# Altium project 025619-TurtleBot4 UI board.PrjPcb (part 1 of 3)
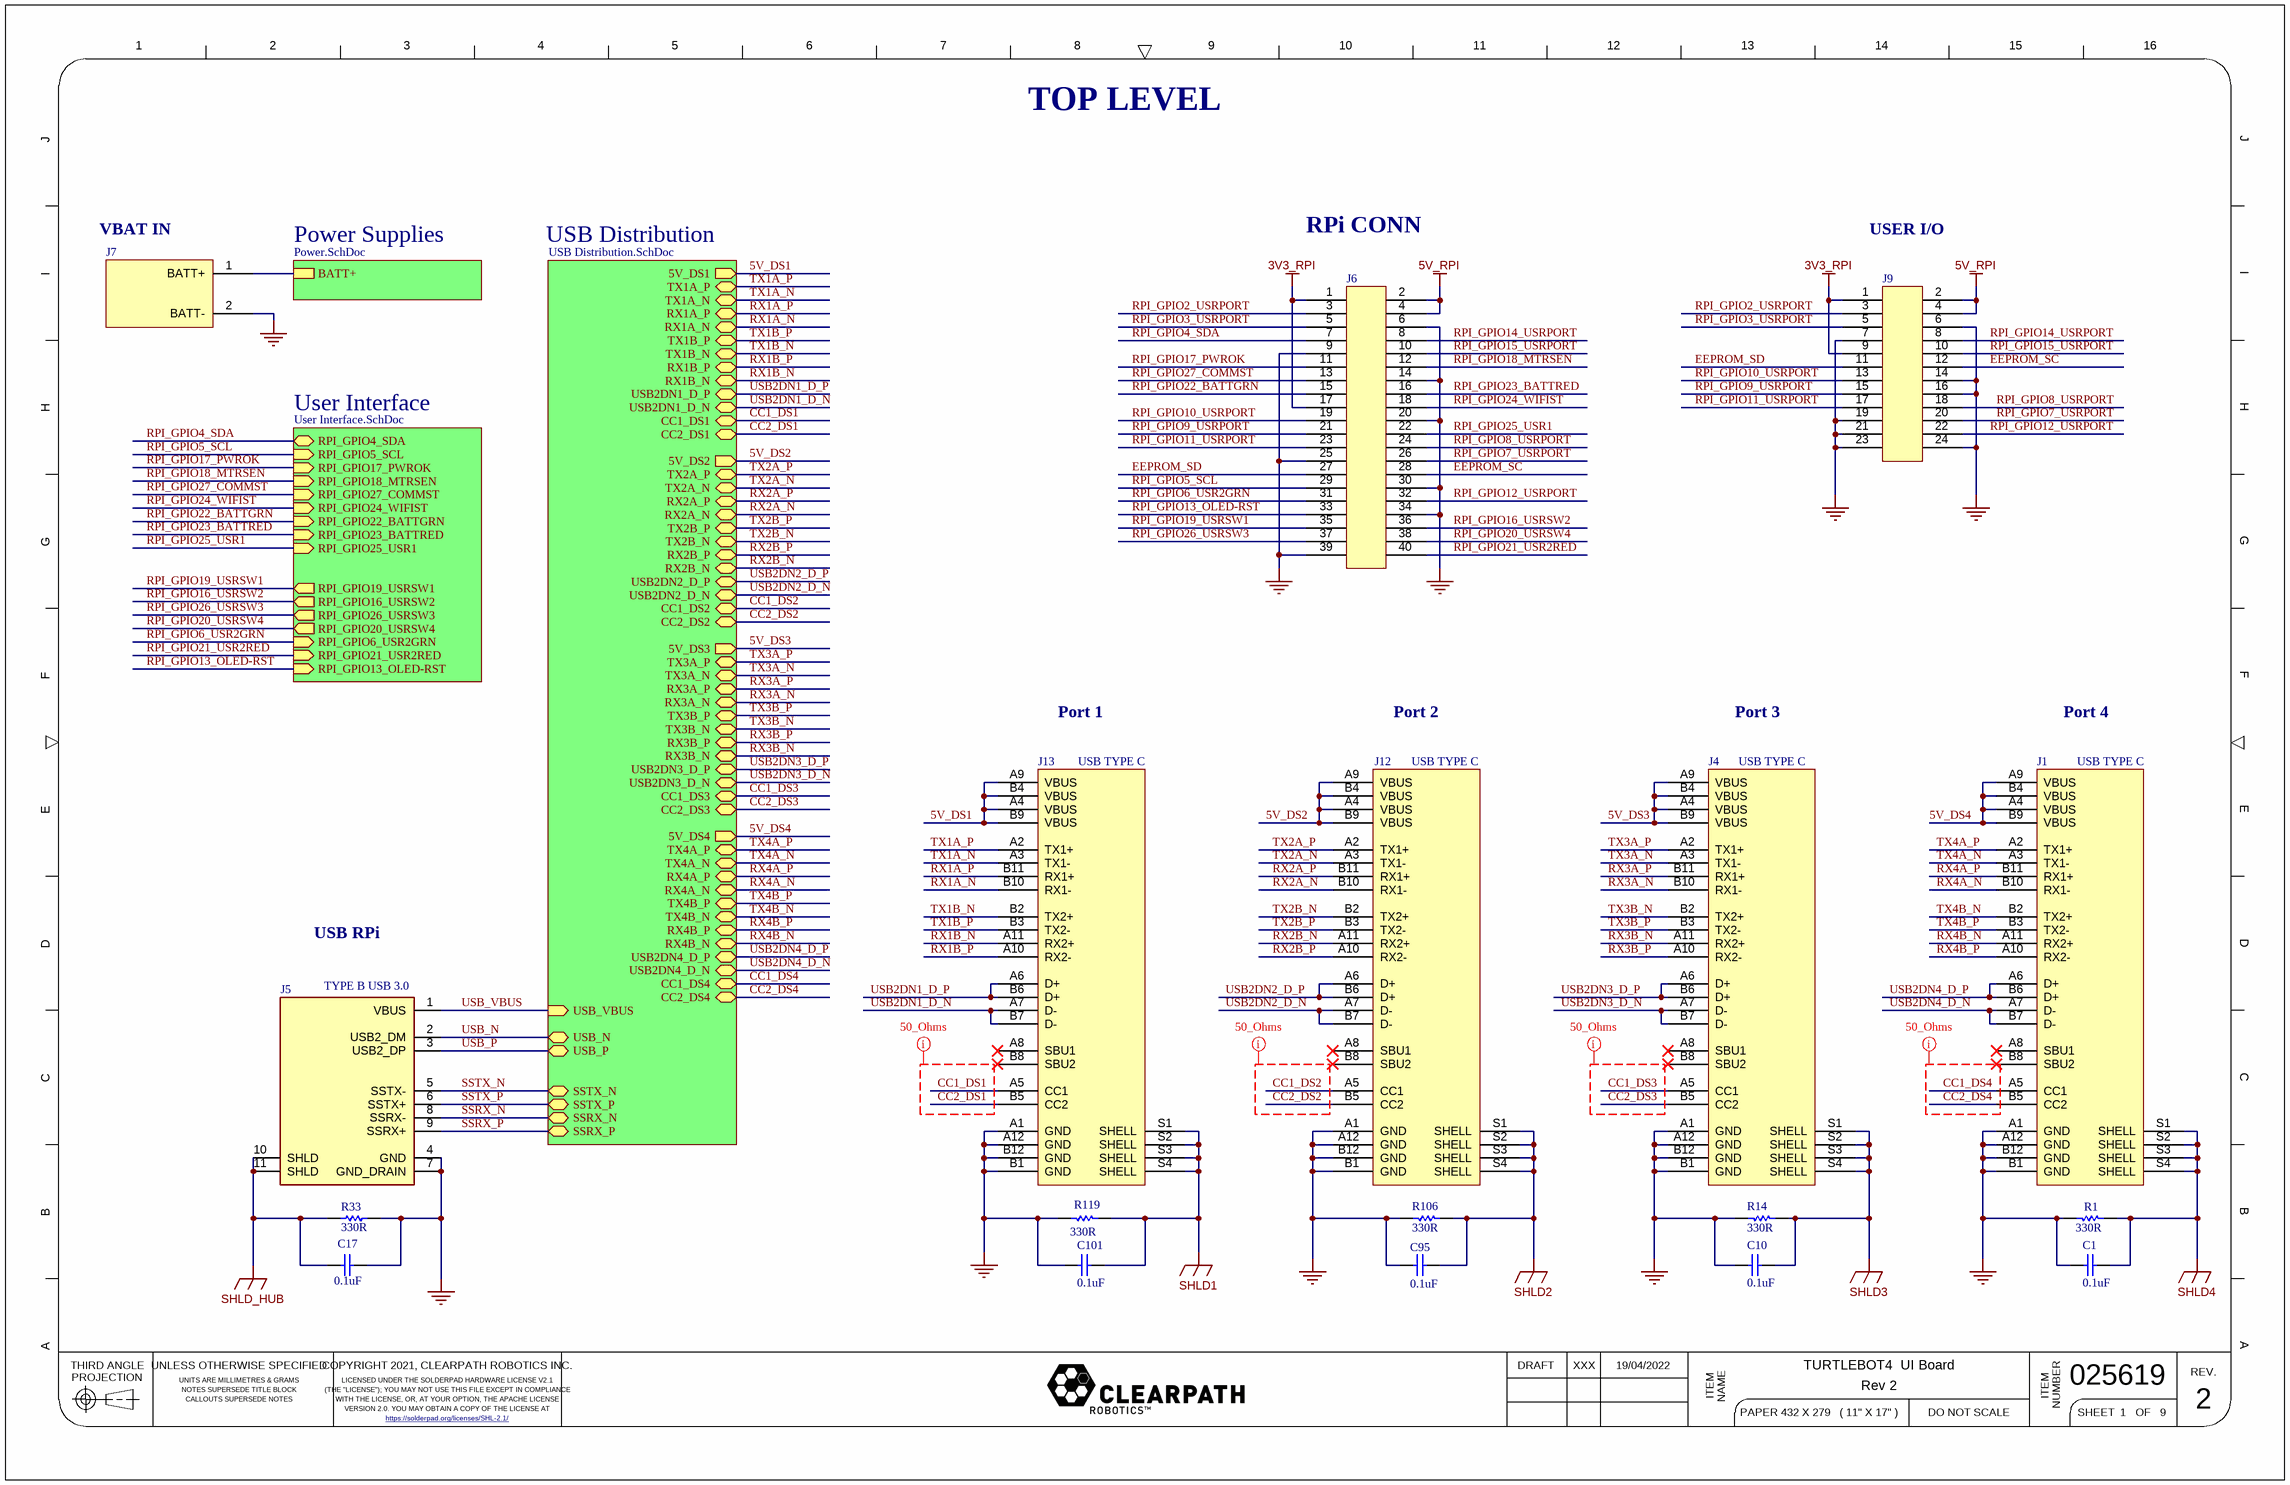
[diagram p0: Top Level.SchDoc]
9 sheets, 378 parts. Net scope: hierarchical (ports join the sheet entries above them; power ports are global).
Board file: 025618-TurtleBot4 UI board .PcbDoc
Sheets:
  Top Level.SchDoc
    User Interface = User Interface.SchDoc
    USB Distribution = USB Distribution.SchDoc
      USB Downstream Port 4 = USB Downstream Type C Port 4.SchDoc
      USB Downstream Port 3 = USB Downstream Type C Port 3.SchDoc
      USB Downstream Port 2 = USB Downstream Type C Port 2.SchDoc
      USB3.0 HUB = USB Hub.SchDoc
      USB Downstream Port 1 = USB Downstream Type C Port 1.SchDoc
    Power Supplies = Power.SchDoc

## Sheet Top Level.SchDoc
size Tabloid; Author: Arash Ghaderi; SheetNumber: 1; SheetTotal: 9; PageSetup: Record=PageOptions|CenterHorizontal=True|CenterVertical=True|PrintScale=1.00|XCorrection=1.00|YCorrection=1.00|PrintKind=1|BorderSize=5000000|LeftOffset=0|BottomOffset=0|Orientation=2|PaperLength=1000|PaperWidth=1000|Scale=100|PaperSource=7|PrintQuality=-4|MediaType=1|DitherType=10|PaperKind=Ledger|PrintScaleMode=1; cpr-ItemNumber: 025619; cpr-ItemName1: TURTLEBOT4  UI Board; cpr-ItemName2: Rev 2; cpr-Revision: 2; cpr-SheetNumber: 1; cpr-SheetTotal: 9; cpr-Draft: XXX; cpr-DraftDate: 19/04/2022; cpr-Rigour1: X; cpr-Rigour2: X; cpr-Rigour1Date: X; cpr-Rigour2Date: X

### Parts
C1  value 0.1uF  [C0805]  (hidden comment: Capacitor _SMT)
C10  value 0.1uF  [C0805]  (hidden comment: Capacitor _SMT)
C17  value 0.1uF  [C0805]  (hidden comment: Capacitor _SMT)
C95  value 0.1uF  [C0805]  (hidden comment: Capacitor _SMT)
C101  value 0.1uF  [C0805]  (hidden comment: Capacitor _SMT)
J1  USB TYPE C  [MOLEX_2012670005]
J4  USB TYPE C  [MOLEX_2012670005]
J5  TYPE B USB 3.0  [1003-024-02000]
J6  Conn_2X20_2  [Conn_2X20_SMT]  (value not drawn)
J7  JST Power Connector  [JST_S2B]  (value not drawn)
J9  AUX_CONNECTOR  [SULLINS_SBH11-NBPC-D12-SM-BK]  (value not drawn)
J12  USB TYPE C  [MOLEX_2012670005]
J13  USB TYPE C  [MOLEX_2012670005]
R1  value 330R  [R0805]  (hidden comment: Resistor_SMT)
R14  value 330R  [R0805]  (hidden comment: Resistor_SMT)
R33  value 330R  [R0805]  (hidden comment: Resistor_SMT)
R106  value 330R  [R0805]  (hidden comment: Resistor_SMT)
R119  value 330R  [R0805]  (hidden comment: Resistor_SMT)

### Sub-sheets
Power Supplies = Power.SchDoc: BATT+
USB Distribution = USB Distribution.SchDoc: RX1A_N (bidir), TX1B_N (bidir), TX1B_P (bidir), CC2_DS1 (bidir), CC1_DS1 (bidir), TX1A_N (bidir), 5V_DS1 (out), TX1A_P (bidir), USB2DN1_D_N (bidir), RX1B_P (bidir), RX1B_N (bidir), RX1A_P (bidir), USB2DN1_D_P (bidir), SSTX_P (bidir), USB_P (bidir), USB_N (bidir), USB_VBUS (in), SSRX_P (bidir), SSRX_N (bidir), SSTX_N (bidir), TX3A_P (bidir), CC1_DS4 (bidir), 5V_DS4 (out), RX2B_N (bidir), TX3B_N (bidir), RX4B_N (bidir), RX2A_N (bidir), USB2DN2_D_P (bidir), USB2DN4_D_N (bidir), RX4A_N (bidir), RX3B_P (bidir), TX4B_N (bidir), RX3A_N (bidir), CC2_DS4 (bidir), TX3A_N (bidir), 5V_DS2 (out), TX4A_P (bidir), RX3B_N (bidir), TX4B_P (bidir), CC2_DS2 (bidir), TX2A_N (bidir), USB2DN3_D_N (bidir), TX4A_N (bidir), RX2B_P (bidir), TX3B_P (bidir), RX4B_P (bidir), TX2B_P (bidir), TX2A_P (bidir), TX2B_N (bidir), USB2DN4_D_P (bidir), 5V_DS3 (out), USB2DN3_D_P (bidir), CC2_DS3 (bidir), RX4A_P (bidir), RX2A_P (bidir), USB2DN2_D_N (bidir), RX3A_P (bidir), CC1_DS3 (bidir), CC1_DS2 (bidir)
User Interface = User Interface.SchDoc: RPI_GPIO27_COMMST (in), RPI_GPIO24_WIFIST (in), RPI_GPIO18_MTRSEN (in), RPI_GPIO5_SCL (in), RPI_GPIO17_PWROK (in), RPI_GPIO23_BATTRED (in), RPI_GPIO20_USRSW4 (out), RPI_GPIO4_SDA (bidir), RPI_GPIO22_BATTGRN (in), RPI_GPIO25_USR1 (in), RPI_GPIO6_USR2GRN (in), RPI_GPIO21_USR2RED (in), RPI_GPIO26_USRSW3 (out), RPI_GPIO16_USRSW2 (out), RPI_GPIO19_USRSW1 (out), RPI_GPIO13_OLED-RST (in)

### Nets
3V3_RPI: J6.1 J6.17 J9.1 J9.9
5V_RPI: J6.2 J6.4 J9.2 J9.4
GND: C1.2 C10.2 C17.2 C95.2 C101.2 J1.A1(GND) J1.A12(GND) J1.B1(GND) J1.B12(GND) J4.A1(GND) J4.A12(GND) J4.B1(GND) J4.B12(GND) J5.4(GND) J5.7(GND_DRAIN) J6.6 J6.9 J6.14 J6.20 J6.25 J6.30 J6.34 J6.39 J7.2(BATT-) J9.6 J9.7 J9.14 J9.16 J9.19 J9.21 J9.23 J9.24 J12.A1(GND) J12.A12(GND) J12.B1(GND) J12.B12(GND) J13.A1(GND) J13.A12(GND) J13.B1(GND) J13.B12(GND) R1.2 R14.2 R33.2 R106.2 R119.2
SHLD1: C101.1 J13.S1(SHELL) J13.S2(SHELL) J13.S3(SHELL) J13.S4(SHELL) R119.1
SHLD2: C95.1 J12.S1(SHELL) J12.S2(SHELL) J12.S3(SHELL) J12.S4(SHELL) R106.1
SHLD3: C10.1 J4.S1(SHELL) J4.S2(SHELL) J4.S3(SHELL) J4.S4(SHELL) R14.1
SHLD4: C1.1 J1.S1(SHELL) J1.S2(SHELL) J1.S3(SHELL) J1.S4(SHELL) R1.1
SHLD_HUB: C17.1 J5.10(SHLD) J5.11(SHLD) R33.1
5V_DS1: J13.A4(VBUS) J13.A9(VBUS) J13.B4(VBUS) J13.B9(VBUS) ; sheet USB Distribution/5V_DS1
5V_DS2: J12.A4(VBUS) J12.A9(VBUS) J12.B4(VBUS) J12.B9(VBUS) ; sheet USB Distribution/5V_DS2
5V_DS3: J4.A4(VBUS) J4.A9(VBUS) J4.B4(VBUS) J4.B9(VBUS) ; sheet USB Distribution/5V_DS3
5V_DS4: J1.A4(VBUS) J1.A9(VBUS) J1.B4(VBUS) J1.B9(VBUS) ; sheet USB Distribution/5V_DS4
CC1_DS1: J13.A5(CC1) ; sheet USB Distribution/CC1_DS1
CC1_DS2: J12.A5(CC1) ; sheet USB Distribution/CC1_DS2
CC1_DS3: J4.A5(CC1) ; sheet USB Distribution/CC1_DS3
CC1_DS4: J1.A5(CC1) ; sheet USB Distribution/CC1_DS4
CC2_DS1: J13.B5(CC2) ; sheet USB Distribution/CC2_DS1
CC2_DS2: J12.B5(CC2) ; sheet USB Distribution/CC2_DS2
CC2_DS3: J4.B5(CC2) ; sheet USB Distribution/CC2_DS3
CC2_DS4: J1.B5(CC2) ; sheet USB Distribution/CC2_DS4
EEPROM_SC: J6.28 J9.12
EEPROM_SD: J6.27 J9.11
RPI_GPIO2_USRPORT: J6.3 J9.3
RPI_GPIO3_USRPORT: J6.5 J9.5
RPI_GPIO4_SDA: J6.7 ; sheet User Interface/RPI_GPIO4_SDA
RPI_GPIO5_SCL: J6.29 ; sheet User Interface/RPI_GPIO5_SCL
RPI_GPIO6_USR2GRN: J6.31 ; sheet User Interface/RPI_GPIO6_USR2GRN
RPI_GPIO7_USRPORT: J6.26 J9.20
RPI_GPIO8_USRPORT: J6.24 J9.18
RPI_GPIO9_USRPORT: J6.21 J9.15
RPI_GPIO10_USRPORT: J6.19 J9.13
RPI_GPIO11_USRPORT: J6.23 J9.17
RPI_GPIO12_USRPORT: J6.32 J9.22
RPI_GPIO13_OLED-RST: J6.33 ; sheet User Interface/RPI_GPIO13_OLED-RST
RPI_GPIO14_USRPORT: J6.8 J9.8
RPI_GPIO15_USRPORT: J6.10 J9.10
RPI_GPIO16_USRSW2: J6.36 ; sheet User Interface/RPI_GPIO16_USRSW2
RPI_GPIO17_PWROK: J6.11 ; sheet User Interface/RPI_GPIO17_PWROK
RPI_GPIO18_MTRSEN: J6.12 ; sheet User Interface/RPI_GPIO18_MTRSEN
RPI_GPIO19_USRSW1: J6.35 ; sheet User Interface/RPI_GPIO19_USRSW1
RPI_GPIO20_USRSW4: J6.38 ; sheet User Interface/RPI_GPIO20_USRSW4
RPI_GPIO21_USR2RED: J6.40 ; sheet User Interface/RPI_GPIO21_USR2RED
RPI_GPIO22_BATTGRN: J6.15 ; sheet User Interface/RPI_GPIO22_BATTGRN
RPI_GPIO23_BATTRED: J6.16 ; sheet User Interface/RPI_GPIO23_BATTRED
RPI_GPIO24_WIFIST: J6.18 ; sheet User Interface/RPI_GPIO24_WIFIST
RPI_GPIO25_USR1: J6.22 ; sheet User Interface/RPI_GPIO25_USR1
RPI_GPIO26_USRSW3: J6.37 ; sheet User Interface/RPI_GPIO26_USRSW3
RPI_GPIO27_COMMST: J6.13 ; sheet User Interface/RPI_GPIO27_COMMST
RX1A_N: J13.B10(RX1-) ; sheet USB Distribution/RX1A_N
RX1A_P: J13.B11(RX1+) ; sheet USB Distribution/RX1A_P
RX1B_N: J13.A11(RX2+) ; sheet USB Distribution/RX1B_N
RX1B_P: J13.A10(RX2-) ; sheet USB Distribution/RX1B_P
RX2A_N: J12.B10(RX1-) ; sheet USB Distribution/RX2A_N
RX2A_P: J12.B11(RX1+) ; sheet USB Distribution/RX2A_P
RX2B_N: J12.A11(RX2+) ; sheet USB Distribution/RX2B_N
RX2B_P: J12.A10(RX2-) ; sheet USB Distribution/RX2B_P
RX3A_N: J4.B10(RX1-) ; sheet USB Distribution/RX3A_N
RX3A_P: J4.B11(RX1+) ; sheet USB Distribution/RX3A_P
RX3B_N: J4.A11(RX2+) ; sheet USB Distribution/RX3B_N
RX3B_P: J4.A10(RX2-) ; sheet USB Distribution/RX3B_P
RX4A_N: J1.B10(RX1-) ; sheet USB Distribution/RX4A_N
RX4A_P: J1.B11(RX1+) ; sheet USB Distribution/RX4A_P
RX4B_N: J1.A11(RX2+) ; sheet USB Distribution/RX4B_N
RX4B_P: J1.A10(RX2-) ; sheet USB Distribution/RX4B_P
SSRX_N: J5.8(SSRX-) ; sheet USB Distribution/SSRX_N
SSRX_P: J5.9(SSRX+) ; sheet USB Distribution/SSRX_P
SSTX_N: J5.5(SSTX-) ; sheet USB Distribution/SSTX_N
SSTX_P: J5.6(SSTX+) ; sheet USB Distribution/SSTX_P
TX1A_N: J13.A3(TX1-) ; sheet USB Distribution/TX1A_N
TX1A_P: J13.A2(TX1+) ; sheet USB Distribution/TX1A_P
TX1B_N: J13.B2(TX2+) ; sheet USB Distribution/TX1B_N
TX1B_P: J13.B3(TX2-) ; sheet USB Distribution/TX1B_P
TX2A_N: J12.A3(TX1-) ; sheet USB Distribution/TX2A_N
TX2A_P: J12.A2(TX1+) ; sheet USB Distribution/TX2A_P
TX2B_N: J12.B2(TX2+) ; sheet USB Distribution/TX2B_N
TX2B_P: J12.B3(TX2-) ; sheet USB Distribution/TX2B_P
TX3A_N: J4.A3(TX1-) ; sheet USB Distribution/TX3A_N
TX3A_P: J4.A2(TX1+) ; sheet USB Distribution/TX3A_P
TX3B_N: J4.B2(TX2+) ; sheet USB Distribution/TX3B_N
TX3B_P: J4.B3(TX2-) ; sheet USB Distribution/TX3B_P
TX4A_N: J1.A3(TX1-) ; sheet USB Distribution/TX4A_N
TX4A_P: J1.A2(TX1+) ; sheet USB Distribution/TX4A_P
TX4B_N: J1.B2(TX2+) ; sheet USB Distribution/TX4B_N
TX4B_P: J1.B3(TX2-) ; sheet USB Distribution/TX4B_P
USB2DN1_D_N: J13.A7(D-) J13.B7(D-) ; sheet USB Distribution/USB2DN1_D_N
USB2DN1_D_P: J13.A6(D+) J13.B6(D+) ; sheet USB Distribution/USB2DN1_D_P
USB2DN2_D_N: J12.A7(D-) J12.B7(D-) ; sheet USB Distribution/USB2DN2_D_N
USB2DN2_D_P: J12.A6(D+) J12.B6(D+) ; sheet USB Distribution/USB2DN2_D_P
USB2DN3_D_N: J4.A7(D-) J4.B7(D-) ; sheet USB Distribution/USB2DN3_D_N
USB2DN3_D_P: J4.A6(D+) J4.B6(D+) ; sheet USB Distribution/USB2DN3_D_P
USB2DN4_D_N: J1.A7(D-) J1.B7(D-) ; sheet USB Distribution/USB2DN4_D_N
USB2DN4_D_P: J1.A6(D+) J1.B6(D+) ; sheet USB Distribution/USB2DN4_D_P
USB_N: J5.2(USB2_DM) ; sheet USB Distribution/USB_N
USB_P: J5.3(USB2_DP) ; sheet USB Distribution/USB_P
USB_VBUS: J5.1(VBUS) ; sheet USB Distribution/USB_VBUS
NetF3_1: J7.1(BATT+) ; sheet Power Supplies/BATT+

Not connected (* = marked no-connect by the designer): J1 A8(SBU1)* B8(SBU2)*; J4 A8(SBU1)* B8(SBU2)*; J12 A8(SBU1)* B8(SBU2)*; J13 A8(SBU1)* B8(SBU2)*

### Layout directives
net class 50_Ohms; rule Width Constraint [Pref Width = 7mil    Min Width = 7mil    Max Width = 7mil]: CC1_DS1, CC1_DS2, CC1_DS3, CC1_DS4, CC2_DS1, CC2_DS2, CC2_DS3, CC2_DS4

### Notes on the sheet
- TOP LEVEL
- VBAT IN
- RPi CONN
- USER I/O
- Port 1
- Port 2
- Port 3
- Port 4
- USB RPi
- 1
- 2
- 3
- 4
- 5
- 6
- 7
- 8
- 9
- 10
- 11
- 12
- 13
- 14
- 15
- 16
- J
- I
- H
- G
- F
- E
- D
- C
- B
- A
- THIRD ANGLE
- PROJECTION
- UNLESS OTHERWISE SPECIFIED
- COPYRIGHT 2021, CLEARPATH ROBOTICS INC.
- DRAFT
- REV.
- UNITS ARE MILLIMETRES & GRAMS
- NOTES SUPERSEDE TITLE BLOCK
- CALLOUTS SUPERSEDE NOTES
- LICENSED UNDER THE SOLDERPAD HARDWARE LICENSE V2.1
- (THE "LICENSE"); YOU MAY NOT USE THIS FILE EXCEPT IN COMPLIANCE
- WITH THE LICENSE, OR, AT YOUR OPTION, THE APACHE LICENSE
- VERSION 2.0. YOU MAY OBTAIN A COPY OF THE LICENSE AT
- https://solderpad.org/licenses/SHL-2.1/ <https://solderpad.https://solderpad.org/licenses/SHL-2.1/org/licenses/SHL-2.1/>
- ITEM
- NAME
- PAPER 432 X 279   ( 11" X 17" )
- DO NOT SCALE
- NUMBER
- SHEET
- OF

### Library data of the parts
C1 C10 C17 C95 C101 = Capacitor _SMT: Capacitor; Tolerance: 10%; Voltage: 50V; Vendor: Digikey; Vendor PN: 311-1140-1-ND; Mfg: Yageo; Mfg PN: CC0805KRX7R9BB104; DNP: *; Package: 0805
J1 J4 J12 J13 = Molex_2012670005: USB Type C receptacle; Vendor: Digikey; Vendor PN: WM17992CT-ND; Mfg: Molex; Mfg PN: 2012670005
J5 = CNC_1003-024-02000: CNC RA USB3.0 Type B; Mfg: CNC Tech; Vendor 1: Digikey; Vendor 1 PN: 1175-1271-ND; Mfg PN: 1003-024-02000
J6 = Conn_2X20_2: sourface mount. 2X20 pin connector meant to connect to ribbon cable; Supplier 1: Digi-Key; Supplier Part Number 1: S9192-ND
J7 = JST_S2B-XH-A(LF)(SN): JST S2B-XH-A(LF)(SN); Vendor: Digikey; Vendor PN: 455-2257-ND; Manufacturer: JST; Mfg PN: S2B-XH-A(LF)(SN)
J9 = Conn_2X12_THU: Supplier 1: Digi-Key; Supplier Part Number 1: S9189-ND
R1 R14 R33 R106 R119 = Resistor_SMT: Resistor; Vendor: Digikey; Vendor PN: 311-330ARCT-ND; Tolerance: 5%; Mfg: Yageo; Mfg PN: RC0805JR-07330RL; Power Rating: *; Package: 0805

## Sheet User Interface.SchDoc: DO NOT FILL THIS IN
size Tabloid; Date: DO NOT FILL THIS IN; ApprovedBy: DO NOT FILL THIS IN; CheckedBy: DO NOT FILL THIS IN; Author: DO NOT FILL THIS IN; CompanyName: DO NOT FILL THIS IN; DrawnBy: DO NOT FILL THIS IN; Engineer: DO NOT FILL THIS IN; Organization: DO NOT FILL THIS IN; Address1: DO NOT FILL THIS IN; Address2: DO NOT FILL THIS IN; Address3: DO NOT FILL THIS IN; Address4: DO NOT FILL THIS IN; DocumentNumber: DO NOT FILL THIS IN; Revision: DO NOT FILL THIS IN; SheetNumber: 2; SheetTotal: 9; PageSetup: Record=PageOptions|CenterHorizontal=True|CenterVertical=True|PrintScale=1.00|XCorrection=1.00|YCorrection=1.00|PrintKind=1|BorderSize=5000000|LeftOffset=0|BottomOffset=0|Orientation=2|PaperLength=1000|PaperWidth=1000|Scale=100|PaperSource=7|PrintQuality=-4|MediaType=1|DitherType=10|PaperKind=Ledger|PrintScaleMode=1; cpr-ItemNumber: 025619; cpr-ItemName1: TurtleBot4 UI board; cpr-ItemName2: Rev 2; cpr-Revision: 2; cpr-SheetNumber: 2; cpr-SheetTotal: 10; cpr-Draft: AG; cpr-DraftDate: 19/04/2022; Time: DO NOT FILL THIS IN; ImagePath: DO NOT FILL THIS IN; Application_BuildNumber: DO NOT FILL THIS IN
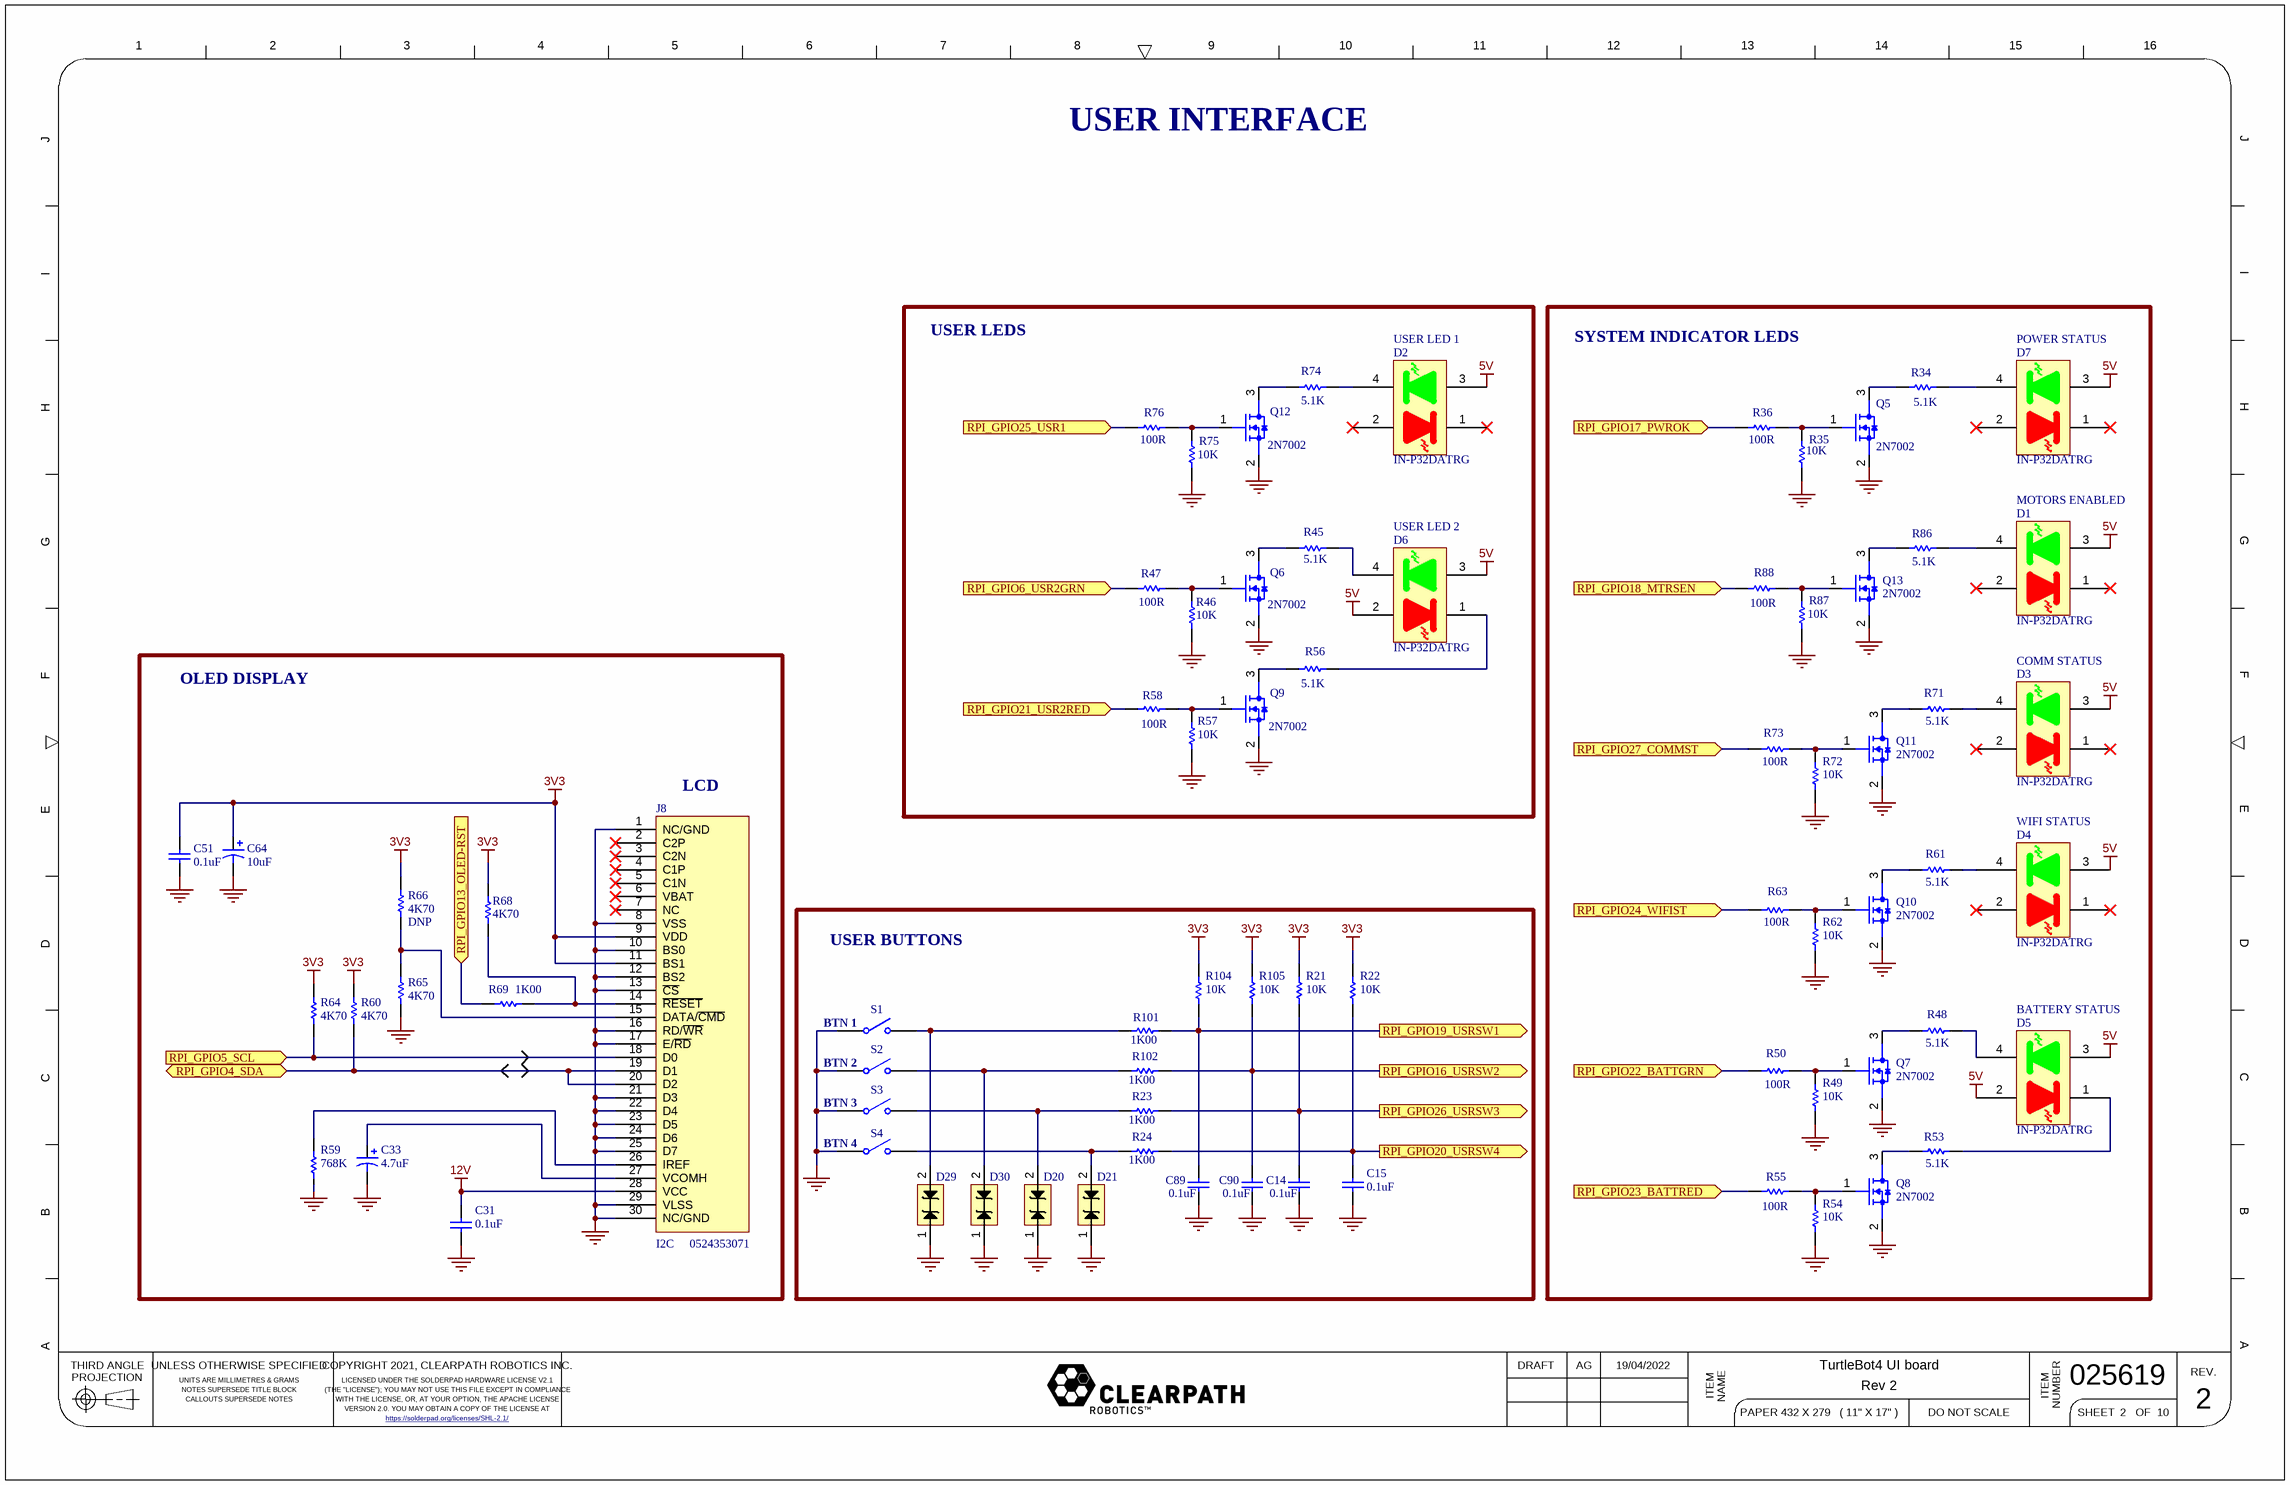
[diagram p1: User Interface.SchDoc]

### Parts
C14  value 0.1uF  [C0805]  (hidden comment: Capacitor _SMT)
C15  value 0.1uF  [C0805]  (hidden comment: Capacitor _SMT)
C31  value 0.1uF  [C0805]  (hidden comment: Capacitor _SMT)
C33  value 4.7uF  [CAP_TANT_3216-18]  (hidden comment: Cap Pol1)
C51  value 0.1uF  [C0805]  (hidden comment: Capacitor _SMT)
C64  value 10uF  [CAP_TANT_3216-18]  (hidden comment: Cap Pol1)
C89  value 0.1uF  [C0805]  (hidden comment: Capacitor _SMT)
C90  value 0.1uF  [C0805]  (hidden comment: Capacitor _SMT)
D1  MOTORS ENABLED  [IN-P32DATRG]
D2  USER LED 1  [IN-P32DATRG]
D3  COMM STATUS  [IN-P32DATRG]
D4  WIFI STATUS  [IN-P32DATRG]
D5  BATTERY STATUS  [IN-P32DATRG]
D6  USER LED 2  [IN-P32DATRG]
D7  POWER STATUS  [IN-P32DATRG]
D20  TVS DIODE BIDIR 15V SMC  [DO-214AA]  (value not drawn)
D21  TVS DIODE BIDIR 15V SMC  [DO-214AA]  (value not drawn)
D29  TVS DIODE BIDIR 15V SMC  [DO-214AA]  (value not drawn)
D30  TVS DIODE BIDIR 15V SMC  [DO-214AA]  (value not drawn)
J8  Mfg PN: 0524353071  [MOLEX_0524353071_REV]  (hidden comment: 128x64 OLED)
Q5  Mfg PN: 2N7002  [SOT-23-3]  (hidden comment: NFET)
Q6  Mfg PN: 2N7002  [SOT-23-3]  (hidden comment: NFET)
Q7  Mfg PN: 2N7002  [SOT-23-3]  (hidden comment: NFET)
Q8  Mfg PN: 2N7002  [SOT-23-3]  (hidden comment: NFET)
Q9  Mfg PN: 2N7002  [SOT-23-3]  (hidden comment: NFET)
Q10  Mfg PN: 2N7002  [SOT-23-3]  (hidden comment: NFET)
Q11  Mfg PN: 2N7002  [SOT-23-3]  (hidden comment: NFET)
Q12  Mfg PN: 2N7002  [SOT-23-3]  (hidden comment: NFET)
Q13  Mfg PN: 2N7002  [SOT-23-3]  (hidden comment: NFET)
R21  value 10K  [R0805]  (hidden comment: Resistor_SMT)
R22  value 10K  [R0805]  (hidden comment: Resistor_SMT)
R23  value 1K00  [R0805]  (hidden comment: Resistor_SMT)
R24  value 1K00  [R0805]  (hidden comment: Resistor_SMT)
R34  value 5.1K  [R0805]  (hidden comment: Resistor_SMT)
R35  value 10K  [R0805]  (hidden comment: Resistor_SMT)
R36  value 100R  [R0805]  (hidden comment: Resistor_SMT)
R45  value 5.1K  [R0805]  (hidden comment: Resistor_SMT)
R46  value 10K  [R0805]  (hidden comment: Resistor_SMT)
R47  value 100R  [R0805]  (hidden comment: Resistor_SMT)
R48  value 5.1K  [R0805]  (hidden comment: Resistor_SMT)
R49  value 10K  [R0805]  (hidden comment: Resistor_SMT)
R50  value 100R  [R0805]  (hidden comment: Resistor_SMT)
R53  value 5.1K  [R0805]  (hidden comment: Resistor_SMT)
R54  value 10K  [R0805]  (hidden comment: Resistor_SMT)
R55  value 100R  [R0805]  (hidden comment: Resistor_SMT)
R56  value 5.1K  [R0805]  (hidden comment: Resistor_SMT)
R57  value 10K  [R0805]  (hidden comment: Resistor_SMT)
R58  value 100R  [R0805]  (hidden comment: Resistor_SMT)
R59  value 768K  [R0805]  (hidden comment: Resistor_SMT)
R60  value 4K70  [R0805]  (hidden comment: Resistor_SMT)
R61  value 5.1K  [R0805]  (hidden comment: Resistor_SMT)
R62  value 10K  [R0805]  (hidden comment: Resistor_SMT)
R63  value 100R  [R0805]  (hidden comment: Resistor_SMT)
R64  value 4K70  [R0805]  (hidden comment: Resistor_SMT)
R65  value 4K70  [R0805]  (hidden comment: Resistor_SMT)
R66  value 4K70  [R0805]  (hidden comment: Resistor_SMT)
R68  value 4K70  [R0805]  (hidden comment: Resistor_SMT)
R69  value 1K00  [R0805]  (hidden comment: Resistor_SMT)
R71  value 5.1K  [R0805]  (hidden comment: Resistor_SMT)
R72  value 10K  [R0805]  (hidden comment: Resistor_SMT)
R73  value 100R  [R0805]  (hidden comment: Resistor_SMT)
R74  value 5.1K  [R0805]  (hidden comment: Resistor_SMT)
R75  value 10K  [R0805]  (hidden comment: Resistor_SMT)
R76  value 100R  [R0805]  (hidden comment: Resistor_SMT)
R86  value 5.1K  [R0805]  (hidden comment: Resistor_SMT)
R87  value 10K  [R0805]  (hidden comment: Resistor_SMT)
R88  value 100R  [R0805]  (hidden comment: Resistor_SMT)
R101  value 1K00  [R0805]  (hidden comment: Resistor_SMT)
R102  value 1K00  [R0805]  (hidden comment: Resistor_SMT)
R104  value 10K  [R0805]  (hidden comment: Resistor_SMT)
R105  value 10K  [R0805]  (hidden comment: Resistor_SMT)
S1  SW-SPST  [PANA_EVP-ASKC1A]  (value not drawn)
S2  SW-SPST  [PANA_EVP-ASKC1A]  (value not drawn)
S3  SW-SPST  [PANA_EVP-ASKC1A]  (value not drawn)
S4  SW-SPST  [PANA_EVP-ASKC1A]  (value not drawn)

### Blocks framed on the sheet
USER LEDS: D2 D6 Q6 Q9 Q12 R45-R47 R56-R58 R74-R76
SYSTEM INDICATOR LEDS: D1 D3-D5 D7 Q5 Q7 Q8 Q10 Q11 Q13 R34-R36 R48-R50 R53-R55 R61-R63 R71-R73 R86-R88
USER BUTTONS: C14 C15 C89 C90 D20 D21 D29 D30 R21-R24 R101 R102 R104 R105 S1-S4

### Ports
RPI_GPIO4_SDA (bidir), RPI_GPIO5_SCL (in), RPI_GPIO6_USR2GRN (in), RPI_GPIO13_OLED-RST (in), RPI_GPIO16_USRSW2 (out), RPI_GPIO17_PWROK (in), RPI_GPIO18_MTRSEN (in), RPI_GPIO19_USRSW1 (out), RPI_GPIO20_USRSW4 (out), RPI_GPIO21_USR2RED (in), RPI_GPIO22_BATTGRN (in), RPI_GPIO23_BATTRED (in), RPI_GPIO24_WIFIST (in), RPI_GPIO25_USR1 (in), RPI_GPIO26_USRSW3 (out), RPI_GPIO27_COMMST (in)

### Nets
3V3: C51.2 C64.1 J8.9(VDD) J8.11(BS1) R21.1 R22.1 R60.1 R64.1 R66.1 R68.1 R104.1 R105.1
5V: D1.3(GA) D2.3(GA) D3.3(GA) D4.3(GA) D5.2(RA) D5.3(GA) D6.2(RA) D6.3(GA) D7.3(GA)
12V: C31.2 J8.28(VCC)
GND: C14.1 C15.1 C31.1 C33.2 C51.1 C64.2 C89.1 C90.1 D20.1 D21.1 D29.1 D30.1 J8.1(NC/GND) J8.8(VSS) J8.10(BS0) J8.12(BS2) J8.13(~{CS}) J8.16(RD/~{WR}) J8.17(E/~{RD}) J8.21(D3) J8.22(D4) J8.23(D5) J8.24(D6) J8.25(D7) J8.29(VLSS) J8.30(NC/GND) Q5.2(D1) Q6.2(D1) Q7.2(D1) Q8.2(D1) Q9.2(D1) Q10.2(D1) Q11.2(D1) Q12.2(D1) Q13.2(D1) R35.2 R46.2 R49.2 R54.2 R57.2 R59.2 R62.2 R65.2 R72.2 R75.2 R87.2 S1.1(COMMON) S2.1(COMMON) S3.1(COMMON) S4.1(COMMON)
RPI_GPIO4_SDA: J8.19(D1) J8.20(D2) R60.2 ; port RPI_GPIO4_SDA
RPI_GPIO5_SCL: J8.18(D0) R64.2 ; port RPI_GPIO5_SCL
RPI_GPIO6_USR2GRN: R47.2 ; port RPI_GPIO6_USR2GRN
RPI_GPIO13_OLED-RST: R69.1 ; port RPI_GPIO13_OLED-RST
RPI_GPIO16_USRSW2: C90.2 R102.1 R105.2 ; port RPI_GPIO16_USRSW2
RPI_GPIO17_PWROK: R36.2 ; port RPI_GPIO17_PWROK
RPI_GPIO18_MTRSEN: R88.2 ; port RPI_GPIO18_MTRSEN
RPI_GPIO19_USRSW1: C89.2 R101.1 R104.2 ; port RPI_GPIO19_USRSW1
RPI_GPIO20_USRSW4: C15.2 R22.2 R24.1 ; port RPI_GPIO20_USRSW4
RPI_GPIO21_USR2RED: R58.2 ; port RPI_GPIO21_USR2RED
RPI_GPIO22_BATTGRN: R50.2 ; port RPI_GPIO22_BATTGRN
RPI_GPIO23_BATTRED: R55.2 ; port RPI_GPIO23_BATTRED
RPI_GPIO24_WIFIST: R63.2 ; port RPI_GPIO24_WIFIST
RPI_GPIO25_USR1: R76.2 ; port RPI_GPIO25_USR1
RPI_GPIO26_USRSW3: C14.2 R21.2 R23.1 ; port RPI_GPIO26_USRSW3
RPI_GPIO27_COMMST: R73.2 ; port RPI_GPIO27_COMMST
NetC33_1: C33.1 J8.27(VCOMH)
NetD1_4: D1.4(GK) R86.1
NetD2_4: D2.4(GK) R74.1
NetD3_4: D3.4(GK) R71.1
NetD4_4: D4.4(GK) R61.1
NetD5_1: D5.1(RK) R53.1
NetD5_4: D5.4(GK) R48.1
NetD6_1: D6.1(RK) R56.1
NetD6_4: D6.4(GK) R45.1
NetD7_4: D7.4(GK) R34.1
NetD20_2: D20.2 R23.2 S3.2(NO)
NetD21_2: D21.2 R24.2 S4.2(NO)
NetD29_2: D29.2 R101.2 S1.2(NO)
NetD30_2: D30.2 R102.2 S2.2(NO)
NetJ8_14: J8.14(~{RESET}) R68.2 R69.2
NetJ8_15: J8.15(DATA/~{CMD}) R65.1 R66.2
NetJ8_26: J8.26(IREF) R59.1
NetQ5_1: Q5.1(G1) R35.1 R36.1
NetQ5_3: Q5.3(S1) R34.2
NetQ6_1: Q6.1(G1) R46.1 R47.1
NetQ6_3: Q6.3(S1) R45.2
NetQ7_1: Q7.1(G1) R49.1 R50.1
NetQ7_3: Q7.3(S1) R48.2
NetQ8_1: Q8.1(G1) R54.1 R55.1
NetQ8_3: Q8.3(S1) R53.2
NetQ9_1: Q9.1(G1) R57.1 R58.1
NetQ9_3: Q9.3(S1) R56.2
NetQ10_1: Q10.1(G1) R62.1 R63.1
NetQ10_3: Q10.3(S1) R61.2
NetQ11_1: Q11.1(G1) R72.1 R73.1
NetQ11_3: Q11.3(S1) R71.2
NetQ12_1: Q12.1(G1) R75.1 R76.1
NetQ12_3: Q12.3(S1) R74.2
NetQ13_1: Q13.1(G1) R87.1 R88.1
NetQ13_3: Q13.3(S1) R86.2

Not connected (* = marked no-connect by the designer): D1 1(RK)* 2(RA)*; D2 1(RK)* 2(RA)*; D3 1(RK)* 2(RA)*; D4 1(RK)* 2(RA)*; D7 1(RK)* 2(RA)*; J8 2(C2P)* 3(C2N)* 4(C1P)* 5(C1N)* 6(VBAT)* 7(NC)*

### Notes on the sheet
- USER INTERFACE
- OLED DISPLAY
- (near J8) LCD
- (near S1) BTN 1
- (near S2) BTN 2
- (near S3) BTN 3
- (near S4) BTN 4
- (near J8) I2C
- 1
- 2
- 3
- 4
- 5
- 6
- 7
- 8
- 9
- 10
- 11
- 12
- 13
- 14
- 15
- 16
- J
- I
- H
- G
- F
- E
- D
- C
- B
- A
- THIRD ANGLE
- PROJECTION
- UNLESS OTHERWISE SPECIFIED
- COPYRIGHT 2021, CLEARPATH ROBOTICS INC.
- DRAFT
- REV.
- UNITS ARE MILLIMETRES & GRAMS
- NOTES SUPERSEDE TITLE BLOCK
- CALLOUTS SUPERSEDE NOTES
- LICENSED UNDER THE SOLDERPAD HARDWARE LICENSE V2.1
- (THE "LICENSE"); YOU MAY NOT USE THIS FILE EXCEPT IN COMPLIANCE
- WITH THE LICENSE, OR, AT YOUR OPTION, THE APACHE LICENSE
- VERSION 2.0. YOU MAY OBTAIN A COPY OF THE LICENSE AT
- https://solderpad.org/licenses/SHL-2.1/ <https://solderpad.https://solderpad.org/licenses/SHL-2.1/org/licenses/SHL-2.1/>
- ITEM
- NAME
- PAPER 432 X 279   ( 11" X 17" )
- DO NOT SCALE
- NUMBER
- SHEET
- OF

### Library data of the parts
C14 C31 C89 C90 = Capacitor _SMT: as C1 on sheet Top Level; DNP: *; Package: 0805
C15 C51 = Capacitor _SMT: Capacitor; Tolerance: 10%; Voltage: 25V; Vendor: Digikey; Vendor PN: 311-1140-1-ND; Mfg: Yageo; Mfg PN: CC0805KRX7R9BB104; DNP: *; Package: 0805
C33 = Cap Pol1: Polarized Capacitor (Radial); Vendor: Digikey; Mfg PN: TAJA475M025RNJ; Vendor PN: 478-8885-1-ND; Voltage: 25V; Tolerance: 10%; Mfg: Kemet; Package: 1206
C64 = Cap Pol1: Polarized Capacitor (Radial); Vendor: Digikey; Mfg PN: T494A106K010AT; Vendor PN: 399-8431-1-ND; Voltage: 10V; Tolerance: 10%; Mfg: Kemet; Package: 1206
D1-D7 = INOLUX IN_P32DATRG LED: Dual Colour LED 3528; Vendor: Digikey; Vendor PN: 1830-1115-1-ND; Mfg: Inolux; Mfg PN: IN-P32DATRG
D20 D21 D29 D30 = TVS DIODE BIDIR 15V SMC: TVS 600W 15V BI-DIR DO-214AA; Vendor: Digikey; Vendor PN: 18-SMA6J5.0CACT-ND; Mfg: Littelfuse Inc.; Mfg PN: SMA6J5.0CA; Package: DO214AC; Supplier 1: Digi-Key; Supplier Part Number 1: 18-SMA6J5.0CACT-ND
J8 = ER-OLED013-1: 128x64 OLED module; Manufacturer: Molex; Vendor PN: WM7976CT-ND; Vendor: Digikey
Q5-Q13 = NFET_SNGL: Vendor: Digikey; Vendor PN: 2N7002NCT-ND; Mfg: ON Semi; Package: SOT23-3
R21 R22 R35 R46 R49 R54 R57 R62 R72 R75 R87 R104 R105 = Resistor_SMT: Resistor; Vendor: Digikey; Vendor PN: 311-10.0KCRCT-ND; Tolerance: 1%; Mfg: Yageo; Mfg PN: RC0805FR-0710KL; Power Rating: *; Package: 0805
R23 R24 R69 R101 R102 = Resistor_SMT: Resistor; Vendor: Digikey; Vendor PN: 311-1.00KCRCT-ND; Tolerance: 1%; Mfg: Yageo; Mfg PN: RC0805FR-071KL; Power Rating: *; Package: 0805
R34 = Resistor_SMT: Resistor; Vendor: Digikey; Tolerance: 1%; Mfg PN: RC0805FR-07768RL; Power Rating: *; Package: 0805; Supplier 1: Digi-Key; Supplier Part Number 1: 311-768CRCT-ND
R36 R47 R50 R55 R58 R63 R73 R76 R88 = Resistor_SMT: Resistor; Vendor: Digikey; Vendor PN: 311-100CRCT-ND; Tolerance: 1%; Mfg: Yageo; Mfg PN: RC0805FR-07100RL; Power Rating: *; Package: 0805
R45 = Resistor_SMT: Resistor; Vendor: Digikey; Vendor PN: 311-82.0CRCT-ND; Tolerance: 1%; Mfg: Yageo; Mfg PN: RC0805FR-07768RL; Power Rating: *; Package: 0805; Supplier 1: Digi-Key; Supplier Part Number 1: 311-768CRCT-ND
R48 R61 R71 R74 = Resistor_SMT: Resistor; Vendor: Digikey; Tolerance: 1%; Mfg: Yageo; Mfg PN: RC0805FR-07768RL; Power Rating: *; Package: 0805; Supplier 1: Digi-Key; Supplier Part Number 1: 311-768CRCT-ND
R53 R56 = Resistor_SMT: Resistor; Vendor: Digikey; Tolerance: 1%; Mfg: Yageo; Mfg PN: RC0805FR-071KL; Power Rating: *; Package: 0805; Supplier 1: Digi-Key; Supplier Part Number 1: 311-1.00KCRTR-ND
R59 = Resistor_SMT: Resistor; Vendor: Digikey; Vendor PN: 311-768KCRCT-ND; Tolerance: 1%; Mfg: Yageo; Mfg PN: RC0805FR-07768KL; Power Rating: *; Package: 0805
R60 R64-R66 R68 = Resistor_SMT: Resistor; Vendor: Digikey; Vendor PN: 13-RC0805FR-104K7LCT-ND; Tolerance: 1%; Mfg: Yageo; Mfg PN: RC0805FR-104K7L; Power Rating: *; Package: 0805
  R66: DNP: DNP
R86 = Resistor_SMT: Resistor; Vendor: Digikey; Tolerance: 1%; Mfg: Yageo; Mfg PN: RC0805FR-0782RL; Power Rating: *; Package: 0805; Supplier 1: Digi-Key; Supplier Part Number 1: 311-768CRCT-ND
S1-S4 = SW-SPST: Single-Pole, Single-Throw Switch; Vendor: Digikey; Vendor PN: P124212CT-ND; Mfg PN: EVP-ASKC1A; Mfg: Panasonic

## Sheet USB Distribution.SchDoc: DO NOT FILL THIS IN
size Tabloid; Date: DO NOT FILL THIS IN; ApprovedBy: DO NOT FILL THIS IN; CheckedBy: DO NOT FILL THIS IN; Author: DO NOT FILL THIS IN; CompanyName: DO NOT FILL THIS IN; DrawnBy: DO NOT FILL THIS IN; Engineer: DO NOT FILL THIS IN; Organization: DO NOT FILL THIS IN; Address1: DO NOT FILL THIS IN; Address2: DO NOT FILL THIS IN; Address3: DO NOT FILL THIS IN; Address4: DO NOT FILL THIS IN; DocumentNumber: DO NOT FILL THIS IN; Revision: DO NOT FILL THIS IN; SheetNumber: 4; SheetTotal: 9; PageSetup: Record=PageOptions|CenterHorizontal=True|CenterVertical=True|PrintScale=1.00|XCorrection=1.00|YCorrection=1.00|PrintKind=1|BorderSize=5000000|LeftOffset=0|BottomOffset=0|Orientation=2|PaperLength=1000|PaperWidth=1000|Scale=100|PaperSource=7|PrintQuality=-4|MediaType=1|DitherType=10|PaperKind=Ledger|PrintScaleMode=1; cpr-ItemNumber: 025619; cpr-ItemName1: TurtleBot4 UI board; cpr-ItemName2: Rev 2; cpr-Revision: 2; cpr-SheetNumber: 4; cpr-SheetTotal: 9; cpr-Draft: AG; cpr-DraftDate: 19/04/2022; cpr-Rigour1: XXX; cpr-Rigour2: XXX; cpr-Rigour1Date: XXX; cpr-Rigour2Date: XXX; Time: DO NOT FILL THIS IN; ImagePath: DO NOT FILL THIS IN; Application_BuildNumber: DO NOT FILL THIS IN
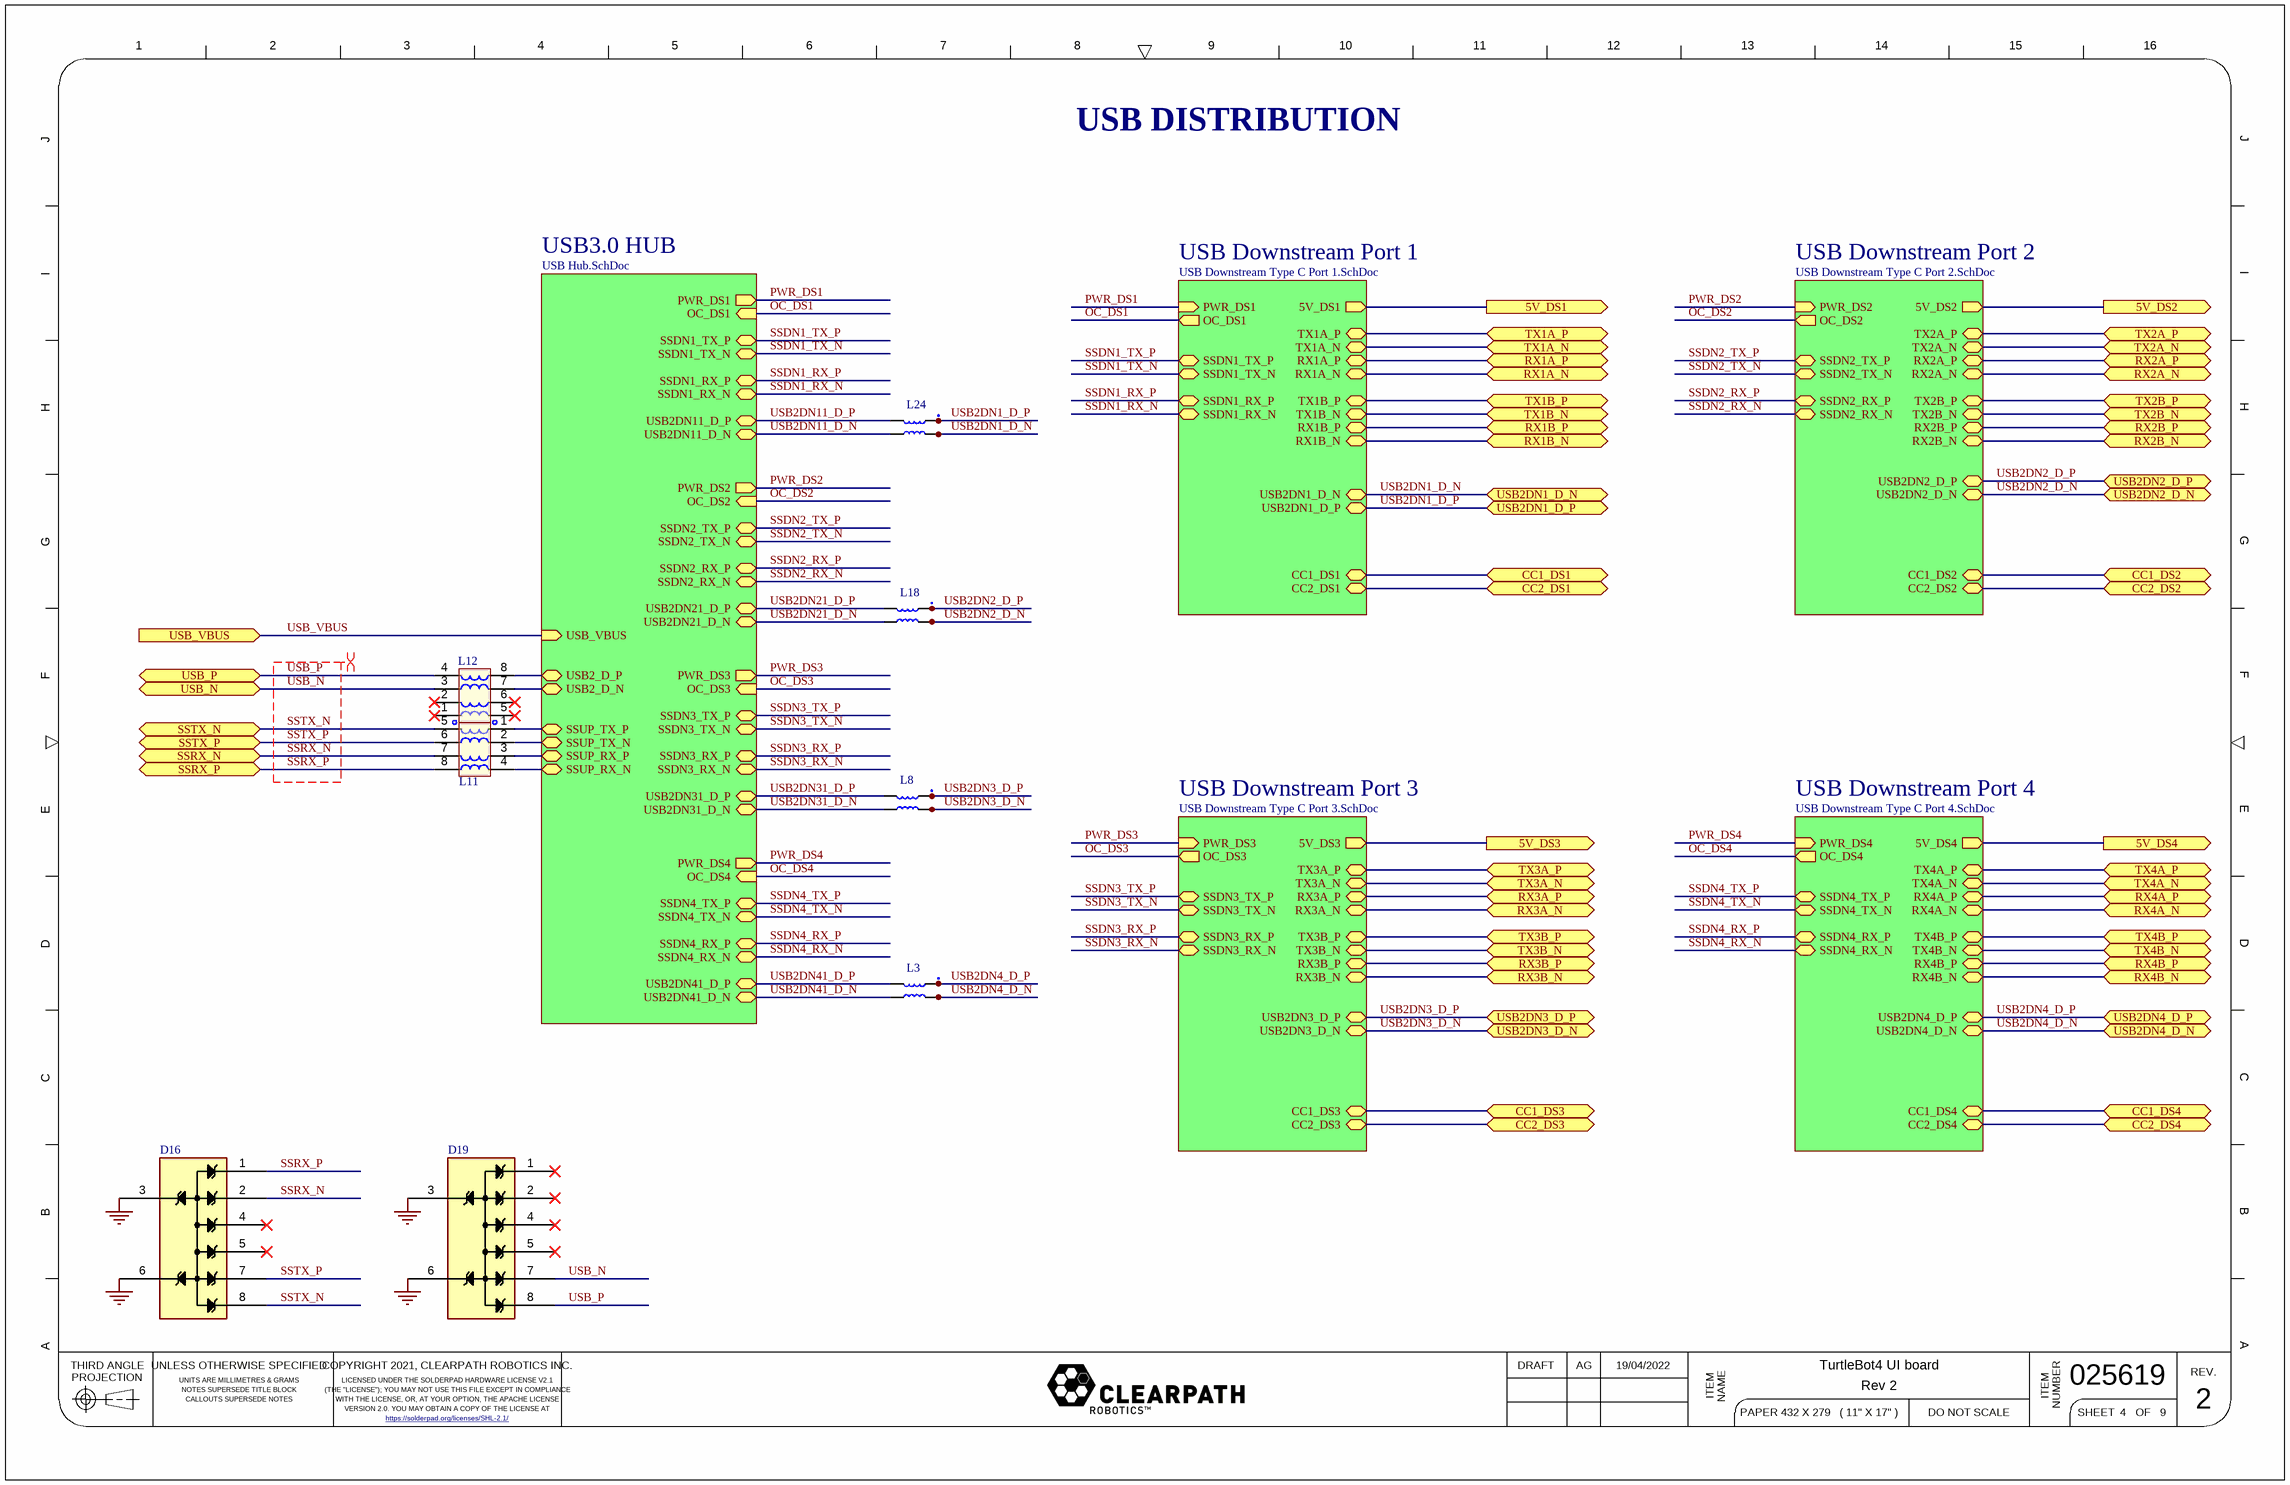
[diagram p2: USB Distribution.SchDoc]

### Parts
D16  ESD7016  [ESD7016]  (value not drawn)
D19  ESD7016  [ESD7016]  (value not drawn)
L3  CMC 100MA 2LN 90 OHM SMD2  [MCZ1210CH900L2]  (value not drawn)
L8  CMC 100MA 2LN 90 OHM SMD2  [MCZ1210CH900L2]  (value not drawn)
L11  CMC 120MA 4LN 90 OHM SMD  [FIL_DLP2ADA900HL4L]  (value not drawn)
L12  CMC 120MA 4LN 90 OHM SMD  [FIL_DLP2ADA900HL4L]  (value not drawn)
L18  CMC 100MA 2LN 90 OHM SMD2  [MCZ1210CH900L2]  (value not drawn)
L24  CMC 100MA 2LN 90 OHM SMD2  [MCZ1210CH900L2]  (value not drawn)

### Sub-sheets
USB3.0 HUB = USB Hub.SchDoc: SSDN1_TX_N (bidir), SSDN1_TX_P (bidir), SSDN1_RX_P (bidir), SSDN1_RX_N (bidir), USB2DN11_D_P (bidir), USB2DN11_D_N (bidir), SSDN2_TX_N (bidir), SSDN2_TX_P (bidir), SSDN2_RX_P (bidir), SSDN2_RX_N (bidir), USB2DN21_D_P (bidir), USB2DN21_D_N (bidir), SSDN3_TX_N (bidir), SSDN3_TX_P (bidir), SSDN3_RX_P (bidir), SSDN3_RX_N (bidir), USB2DN31_D_P (bidir), USB2DN31_D_N (bidir), SSDN4_TX_N (bidir), SSDN4_TX_P (bidir), SSDN4_RX_P (bidir), SSDN4_RX_N (bidir), USB2DN41_D_P (bidir), USB2DN41_D_N (bidir), PWR_DS1 (out), PWR_DS2 (out), PWR_DS3 (out), PWR_DS4 (out), OC_DS1 (in), OC_DS2 (in), OC_DS3 (in), OC_DS4 (in), SSUP_TX_N (bidir), USB2_D_N (bidir), USB2_D_P (bidir), SSUP_TX_P (bidir), SSUP_RX_N (bidir), SSUP_RX_P (bidir), USB_VBUS (in)
USB Downstream Port 1 = USB Downstream Type C Port 1.SchDoc: SSDN1_TX_N (bidir), SSDN1_TX_P (bidir), SSDN1_RX_P (bidir), SSDN1_RX_N (bidir), USB2DN1_D_P (bidir), USB2DN1_D_N (bidir), PWR_DS1 (in), OC_DS1 (out), RX1A_N (bidir), TX1B_N (bidir), TX1B_P (bidir), CC2_DS1 (bidir), CC1_DS1 (bidir), TX1A_N (bidir), 5V_DS1 (out), TX1A_P (bidir), RX1B_P (bidir), RX1B_N (bidir), RX1A_P (bidir)
USB Downstream Port 2 = USB Downstream Type C Port 2.SchDoc: SSDN2_TX_N (bidir), SSDN2_TX_P (bidir), SSDN2_RX_P (bidir), SSDN2_RX_N (bidir), PWR_DS2 (in), OC_DS2 (out), RX2B_P (bidir), RX2B_N (bidir), TX2B_N (bidir), TX2B_P (bidir), CC1_DS2 (bidir), USB2DN2_D_N (bidir), RX2A_P (bidir), RX2A_N (bidir), USB2DN2_D_P (bidir), CC2_DS2 (bidir), TX2A_N (bidir), TX2A_P (bidir), 5V_DS2 (out)
USB Downstream Port 3 = USB Downstream Type C Port 3.SchDoc: SSDN3_TX_N (bidir), SSDN3_TX_P (bidir), SSDN3_RX_P (bidir), SSDN3_RX_N (bidir), PWR_DS3 (in), OC_DS3 (out), RX3A_P (bidir), CC2_DS3 (bidir), 5V_DS3 (out), TX3A_P (bidir), TX3A_N (bidir), CC1_DS3 (bidir), USB2DN3_D_N (bidir), USB2DN3_D_P (bidir), RX3A_N (bidir), RX3B_P (bidir), RX3B_N (bidir), TX3B_P (bidir), TX3B_N (bidir)
USB Downstream Port 4 = USB Downstream Type C Port 4.SchDoc: SSDN4_TX_N (bidir), SSDN4_TX_P (bidir), SSDN4_RX_P (bidir), SSDN4_RX_N (bidir), PWR_DS4 (in), OC_DS4 (out), 5V_DS4 (out), RX4A_P (bidir), TX4A_P (bidir), USB2DN4_D_P (bidir), RX4B_N (bidir), CC2_DS4 (bidir), RX4B_P (bidir), TX4B_P (bidir), RX4A_N (bidir), TX4A_N (bidir), CC1_DS4 (bidir), TX4B_N (bidir), USB2DN4_D_N (bidir)

### Ports
5V_DS1 (out), 5V_DS2 (out), 5V_DS3 (out), 5V_DS4 (out), CC1_DS1 (bidir), CC1_DS2 (bidir), CC1_DS3 (bidir), CC1_DS4 (bidir), CC2_DS1 (bidir), CC2_DS2 (bidir), CC2_DS3 (bidir), CC2_DS4 (bidir), RX1A_N (bidir), RX1A_P (bidir), RX1B_N (bidir), RX1B_P (bidir), RX2A_N (bidir), RX2A_P (bidir), RX2B_N (bidir), RX2B_P (bidir), RX3A_N (bidir), RX3A_P (bidir), RX3B_N (bidir), RX3B_P (bidir), RX4A_N (bidir), RX4A_P (bidir), RX4B_N (bidir), RX4B_P (bidir), SSRX_N (bidir), SSRX_P (bidir), SSTX_N (bidir), SSTX_P (bidir), TX1A_N (bidir), TX1A_P (bidir), TX1B_N (bidir), TX1B_P (bidir), TX2A_N (bidir), TX2A_P (bidir), TX2B_N (bidir), TX2B_P (bidir), TX3A_N (bidir), TX3A_P (bidir), TX3B_N (bidir), TX3B_P (bidir), TX4A_N (bidir), TX4A_P (bidir), TX4B_N (bidir), TX4B_P (bidir), USB2DN1_D_N (bidir), USB2DN1_D_P (bidir), USB2DN2_D_N (bidir), USB2DN2_D_P (bidir), USB2DN3_D_N (bidir), USB2DN3_D_P (bidir), USB2DN4_D_N (bidir), USB2DN4_D_P (bidir), USB_N (bidir), USB_P (bidir), USB_VBUS (in)

### Nets
GND: D16.3 D16.6 D19.3 D19.6
5V_DS1: port 5V_DS1, sheet USB Downstream Port 1/5V_DS1
5V_DS2: port 5V_DS2, sheet USB Downstream Port 2/5V_DS2
5V_DS3: port 5V_DS3, sheet USB Downstream Port 3/5V_DS3
5V_DS4: port 5V_DS4, sheet USB Downstream Port 4/5V_DS4
CC1_DS1: port CC1_DS1, sheet USB Downstream Port 1/CC1_DS1
CC1_DS2: port CC1_DS2, sheet USB Downstream Port 2/CC1_DS2
CC1_DS3: port CC1_DS3, sheet USB Downstream Port 3/CC1_DS3
CC1_DS4: port CC1_DS4, sheet USB Downstream Port 4/CC1_DS4
CC2_DS1: port CC2_DS1, sheet USB Downstream Port 1/CC2_DS1
CC2_DS2: port CC2_DS2, sheet USB Downstream Port 2/CC2_DS2
CC2_DS3: port CC2_DS3, sheet USB Downstream Port 3/CC2_DS3
CC2_DS4: port CC2_DS4, sheet USB Downstream Port 4/CC2_DS4
OC_DS1: sheet USB3.0 HUB/OC_DS1, sheet USB Downstream Port 1/OC_DS1
OC_DS2: sheet USB Downstream Port 2/OC_DS2, sheet USB3.0 HUB/OC_DS2
OC_DS3: sheet USB Downstream Port 3/OC_DS3, sheet USB3.0 HUB/OC_DS3
OC_DS4: sheet USB Downstream Port 4/OC_DS4, sheet USB3.0 HUB/OC_DS4
PWR_DS1: sheet USB3.0 HUB/PWR_DS1, sheet USB Downstream Port 1/PWR_DS1
PWR_DS2: sheet USB Downstream Port 2/PWR_DS2, sheet USB3.0 HUB/PWR_DS2
PWR_DS3: sheet USB Downstream Port 3/PWR_DS3, sheet USB3.0 HUB/PWR_DS3
PWR_DS4: sheet USB Downstream Port 4/PWR_DS4, sheet USB3.0 HUB/PWR_DS4
RX1A_N: port RX1A_N, sheet USB Downstream Port 1/RX1A_N
RX1A_P: port RX1A_P, sheet USB Downstream Port 1/RX1A_P
RX1B_N: port RX1B_N, sheet USB Downstream Port 1/RX1B_N
RX1B_P: port RX1B_P, sheet USB Downstream Port 1/RX1B_P
RX2A_N: port RX2A_N, sheet USB Downstream Port 2/RX2A_N
RX2A_P: port RX2A_P, sheet USB Downstream Port 2/RX2A_P
RX2B_N: port RX2B_N, sheet USB Downstream Port 2/RX2B_N
RX2B_P: port RX2B_P, sheet USB Downstream Port 2/RX2B_P
RX3A_N: port RX3A_N, sheet USB Downstream Port 3/RX3A_N
RX3A_P: port RX3A_P, sheet USB Downstream Port 3/RX3A_P
RX3B_N: port RX3B_N, sheet USB Downstream Port 3/RX3B_N
RX3B_P: port RX3B_P, sheet USB Downstream Port 3/RX3B_P
RX4A_N: port RX4A_N, sheet USB Downstream Port 4/RX4A_N
RX4A_P: port RX4A_P, sheet USB Downstream Port 4/RX4A_P
RX4B_N: port RX4B_N, sheet USB Downstream Port 4/RX4B_N
RX4B_P: port RX4B_P, sheet USB Downstream Port 4/RX4B_P
SSDN1_RX_N: sheet USB3.0 HUB/SSDN1_RX_N, sheet USB Downstream Port 1/SSDN1_RX_N
SSDN1_RX_P: sheet USB3.0 HUB/SSDN1_RX_P, sheet USB Downstream Port 1/SSDN1_RX_P
SSDN1_TX_N: sheet USB3.0 HUB/SSDN1_TX_N, sheet USB Downstream Port 1/SSDN1_TX_N
SSDN1_TX_P: sheet USB3.0 HUB/SSDN1_TX_P, sheet USB Downstream Port 1/SSDN1_TX_P
SSDN2_RX_N: sheet USB Downstream Port 2/SSDN2_RX_N, sheet USB3.0 HUB/SSDN2_RX_N
SSDN2_RX_P: sheet USB Downstream Port 2/SSDN2_RX_P, sheet USB3.0 HUB/SSDN2_RX_P
SSDN2_TX_N: sheet USB Downstream Port 2/SSDN2_TX_N, sheet USB3.0 HUB/SSDN2_TX_N
SSDN2_TX_P: sheet USB Downstream Port 2/SSDN2_TX_P, sheet USB3.0 HUB/SSDN2_TX_P
SSDN3_RX_N: sheet USB Downstream Port 3/SSDN3_RX_N, sheet USB3.0 HUB/SSDN3_RX_N
SSDN3_RX_P: sheet USB Downstream Port 3/SSDN3_RX_P, sheet USB3.0 HUB/SSDN3_RX_P
SSDN3_TX_N: sheet USB Downstream Port 3/SSDN3_TX_N, sheet USB3.0 HUB/SSDN3_TX_N
SSDN3_TX_P: sheet USB Downstream Port 3/SSDN3_TX_P, sheet USB3.0 HUB/SSDN3_TX_P
SSDN4_RX_N: sheet USB Downstream Port 4/SSDN4_RX_N, sheet USB3.0 HUB/SSDN4_RX_N
SSDN4_RX_P: sheet USB Downstream Port 4/SSDN4_RX_P, sheet USB3.0 HUB/SSDN4_RX_P
SSDN4_TX_N: sheet USB Downstream Port 4/SSDN4_TX_N, sheet USB3.0 HUB/SSDN4_TX_N
SSDN4_TX_P: sheet USB Downstream Port 4/SSDN4_TX_P, sheet USB3.0 HUB/SSDN4_TX_P
SSRX_N: D16.2 L11.7 ; port SSRX_N
SSRX_P: D16.1 L11.8 ; port SSRX_P
SSTX_N: D16.8 L11.5 ; port SSTX_N
SSTX_P: D16.7 L11.6 ; port SSTX_P
SSUP_RX_N: L11.4 ; sheet USB3.0 HUB/SSUP_RX_N
SSUP_RX_P: L11.3 ; sheet USB3.0 HUB/SSUP_RX_P
SSUP_TX_N: L11.2 ; sheet USB3.0 HUB/SSUP_TX_N
SSUP_TX_P: L11.1 ; sheet USB3.0 HUB/SSUP_TX_P
TX1A_N: port TX1A_N, sheet USB Downstream Port 1/TX1A_N
TX1A_P: port TX1A_P, sheet USB Downstream Port 1/TX1A_P
TX1B_N: port TX1B_N, sheet USB Downstream Port 1/TX1B_N
TX1B_P: port TX1B_P, sheet USB Downstream Port 1/TX1B_P
TX2A_N: port TX2A_N, sheet USB Downstream Port 2/TX2A_N
TX2A_P: port TX2A_P, sheet USB Downstream Port 2/TX2A_P
TX2B_N: port TX2B_N, sheet USB Downstream Port 2/TX2B_N
TX2B_P: port TX2B_P, sheet USB Downstream Port 2/TX2B_P
TX3A_N: port TX3A_N, sheet USB Downstream Port 3/TX3A_N
TX3A_P: port TX3A_P, sheet USB Downstream Port 3/TX3A_P
TX3B_N: port TX3B_N, sheet USB Downstream Port 3/TX3B_N
TX3B_P: port TX3B_P, sheet USB Downstream Port 3/TX3B_P
TX4A_N: port TX4A_N, sheet USB Downstream Port 4/TX4A_N
TX4A_P: port TX4A_P, sheet USB Downstream Port 4/TX4A_P
TX4B_N: port TX4B_N, sheet USB Downstream Port 4/TX4B_N
TX4B_P: port TX4B_P, sheet USB Downstream Port 4/TX4B_P
USB2_D_N: L12.7 ; sheet USB3.0 HUB/USB2_D_N
USB2_D_P: L12.8 ; sheet USB3.0 HUB/USB2_D_P
USB2DN1_D_N: L24.2 ; port USB2DN1_D_N, sheet USB Downstream Port 1/USB2DN1_D_N
USB2DN1_D_P: L24.1 ; port USB2DN1_D_P, sheet USB Downstream Port 1/USB2DN1_D_P
USB2DN2_D_N: L18.2 ; port USB2DN2_D_N, sheet USB Downstream Port 2/USB2DN2_D_N
USB2DN2_D_P: L18.1 ; port USB2DN2_D_P, sheet USB Downstream Port 2/USB2DN2_D_P
USB2DN3_D_N: L8.2 ; port USB2DN3_D_N, sheet USB Downstream Port 3/USB2DN3_D_N
USB2DN3_D_P: L8.1 ; port USB2DN3_D_P, sheet USB Downstream Port 3/USB2DN3_D_P
USB2DN4_D_N: L3.2 ; port USB2DN4_D_N, sheet USB Downstream Port 4/USB2DN4_D_N
USB2DN4_D_P: L3.1 ; port USB2DN4_D_P, sheet USB Downstream Port 4/USB2DN4_D_P
USB2DN11_D_N: L24.3 ; sheet USB3.0 HUB/USB2DN11_D_N
USB2DN11_D_P: L24.4 ; sheet USB3.0 HUB/USB2DN11_D_P
USB2DN21_D_N: L18.3 ; sheet USB3.0 HUB/USB2DN21_D_N
USB2DN21_D_P: L18.4 ; sheet USB3.0 HUB/USB2DN21_D_P
USB2DN31_D_N: L8.3 ; sheet USB3.0 HUB/USB2DN31_D_N
USB2DN31_D_P: L8.4 ; sheet USB3.0 HUB/USB2DN31_D_P
USB2DN41_D_N: L3.3 ; sheet USB3.0 HUB/USB2DN41_D_N
USB2DN41_D_P: L3.4 ; sheet USB3.0 HUB/USB2DN41_D_P
USB_N: D19.7 L12.3 ; port USB_N
USB_P: D19.8 L12.4 ; port USB_P
USB_VBUS: port USB_VBUS, sheet USB3.0 HUB/USB_VBUS

Not connected (* = marked no-connect by the designer): D16 4* 5*; D19 1* 2* 4* 5*; L12 1* 2* 5* 6*

### Layout directives
differential pair; net class USB3; differential pair class DIFF90; rule Matched Net Lengths [Tolerance = 15mil]: SSRX_N, SSRX_P, SSTX_N, SSTX_P, USB_N, USB_P

### Notes on the sheet
- USB DISTRIBUTION
- 1
- 2
- 3
- 4
- 5
- 6
- 7
- 8
- 9
- 10
- 11
- 12
- 13
- 14
- 15
- 16
- J
- I
- H
- G
- F
- E
- D
- C
- B
- A
- THIRD ANGLE
- PROJECTION
- UNLESS OTHERWISE SPECIFIED
- COPYRIGHT 2021, CLEARPATH ROBOTICS INC.
- DRAFT
- REV.
- UNITS ARE MILLIMETRES & GRAMS
- NOTES SUPERSEDE TITLE BLOCK
- CALLOUTS SUPERSEDE NOTES
- LICENSED UNDER THE SOLDERPAD HARDWARE LICENSE V2.1
- (THE "LICENSE"); YOU MAY NOT USE THIS FILE EXCEPT IN COMPLIANCE
- WITH THE LICENSE, OR, AT YOUR OPTION, THE APACHE LICENSE
- VERSION 2.0. YOU MAY OBTAIN A COPY OF THE LICENSE AT
- https://solderpad.org/licenses/SHL-2.1/ <https://solderpad.https://solderpad.org/licenses/SHL-2.1/org/licenses/SHL-2.1/>
- ITEM
- NAME
- PAPER 432 X 279   ( 11" X 17" )
- DO NOT SCALE
- NUMBER
- SHEET
- OF

### Library data of the parts
D16 D19 = ESD7016: USB3 TVS diode assy; Vendor 1: Digikey; Vendor 1 PN: ESD7016MUTAGOSCT-ND; Mfg: ON Semi; Mfg PN: ESD7016MUTAG; Vendor 2 PN: *; Vendor 2: *
L3 L8 L18 L24 = CMC 90_Ohms: Line Common Mode Choke Surface Mount 90 Ohms 100mA DCR 5Ohm; Supplier 1: Digi-Key; Supplier Part Number 1: 490-16595-1-ND
L11 L12 = DLP2ADA900HL4L: Chip Common Mode Choke Coil Arrays; Package: None; Price: None; Value: *; MP: DLP2ADA900HL4L; Availability: Unavailable; Supplier 1: Digi-Key; Supplier Part Number 1: 490-11096-1-ND

## Sheet USB Downstream Type C Port 4.SchDoc: DO NOT FILL THIS IN
size Tabloid; Date: DO NOT FILL THIS IN; ApprovedBy: DO NOT FILL THIS IN; CheckedBy: DO NOT FILL THIS IN; Author: DO NOT FILL THIS IN; CompanyName: DO NOT FILL THIS IN; DrawnBy: DO NOT FILL THIS IN; Engineer: DO NOT FILL THIS IN; Organization: DO NOT FILL THIS IN; Address1: DO NOT FILL THIS IN; Address2: DO NOT FILL THIS IN; Address3: DO NOT FILL THIS IN; Address4: DO NOT FILL THIS IN; DocumentNumber: DO NOT FILL THIS IN; Revision: DO NOT FILL THIS IN; SheetNumber: 8; SheetTotal: 9; PageSetup: Record=PageOptions|CenterHorizontal=True|CenterVertical=True|PrintScale=1.00|XCorrection=1.00|YCorrection=1.00|PrintKind=1|BorderSize=5000000|LeftOffset=0|BottomOffset=0|Orientation=2|PaperLength=1000|PaperWidth=1000|Scale=100|PaperSource=7|PrintQuality=-4|MediaType=1|DitherType=10|PaperKind=Ledger|PrintScaleMode=1; cpr-ItemNumber: 025619; cpr-ItemName1: TurtleBot4 UI board; cpr-ItemName2: Rev 2; cpr-Revision: 2; cpr-SheetNumber: 8; cpr-SheetTotal: 9; cpr-Draft: AG; cpr-DraftDate: 19/04/2022; Time: DO NOT FILL THIS IN; ImagePath: DO NOT FILL THIS IN; Application_BuildNumber: DO NOT FILL THIS IN
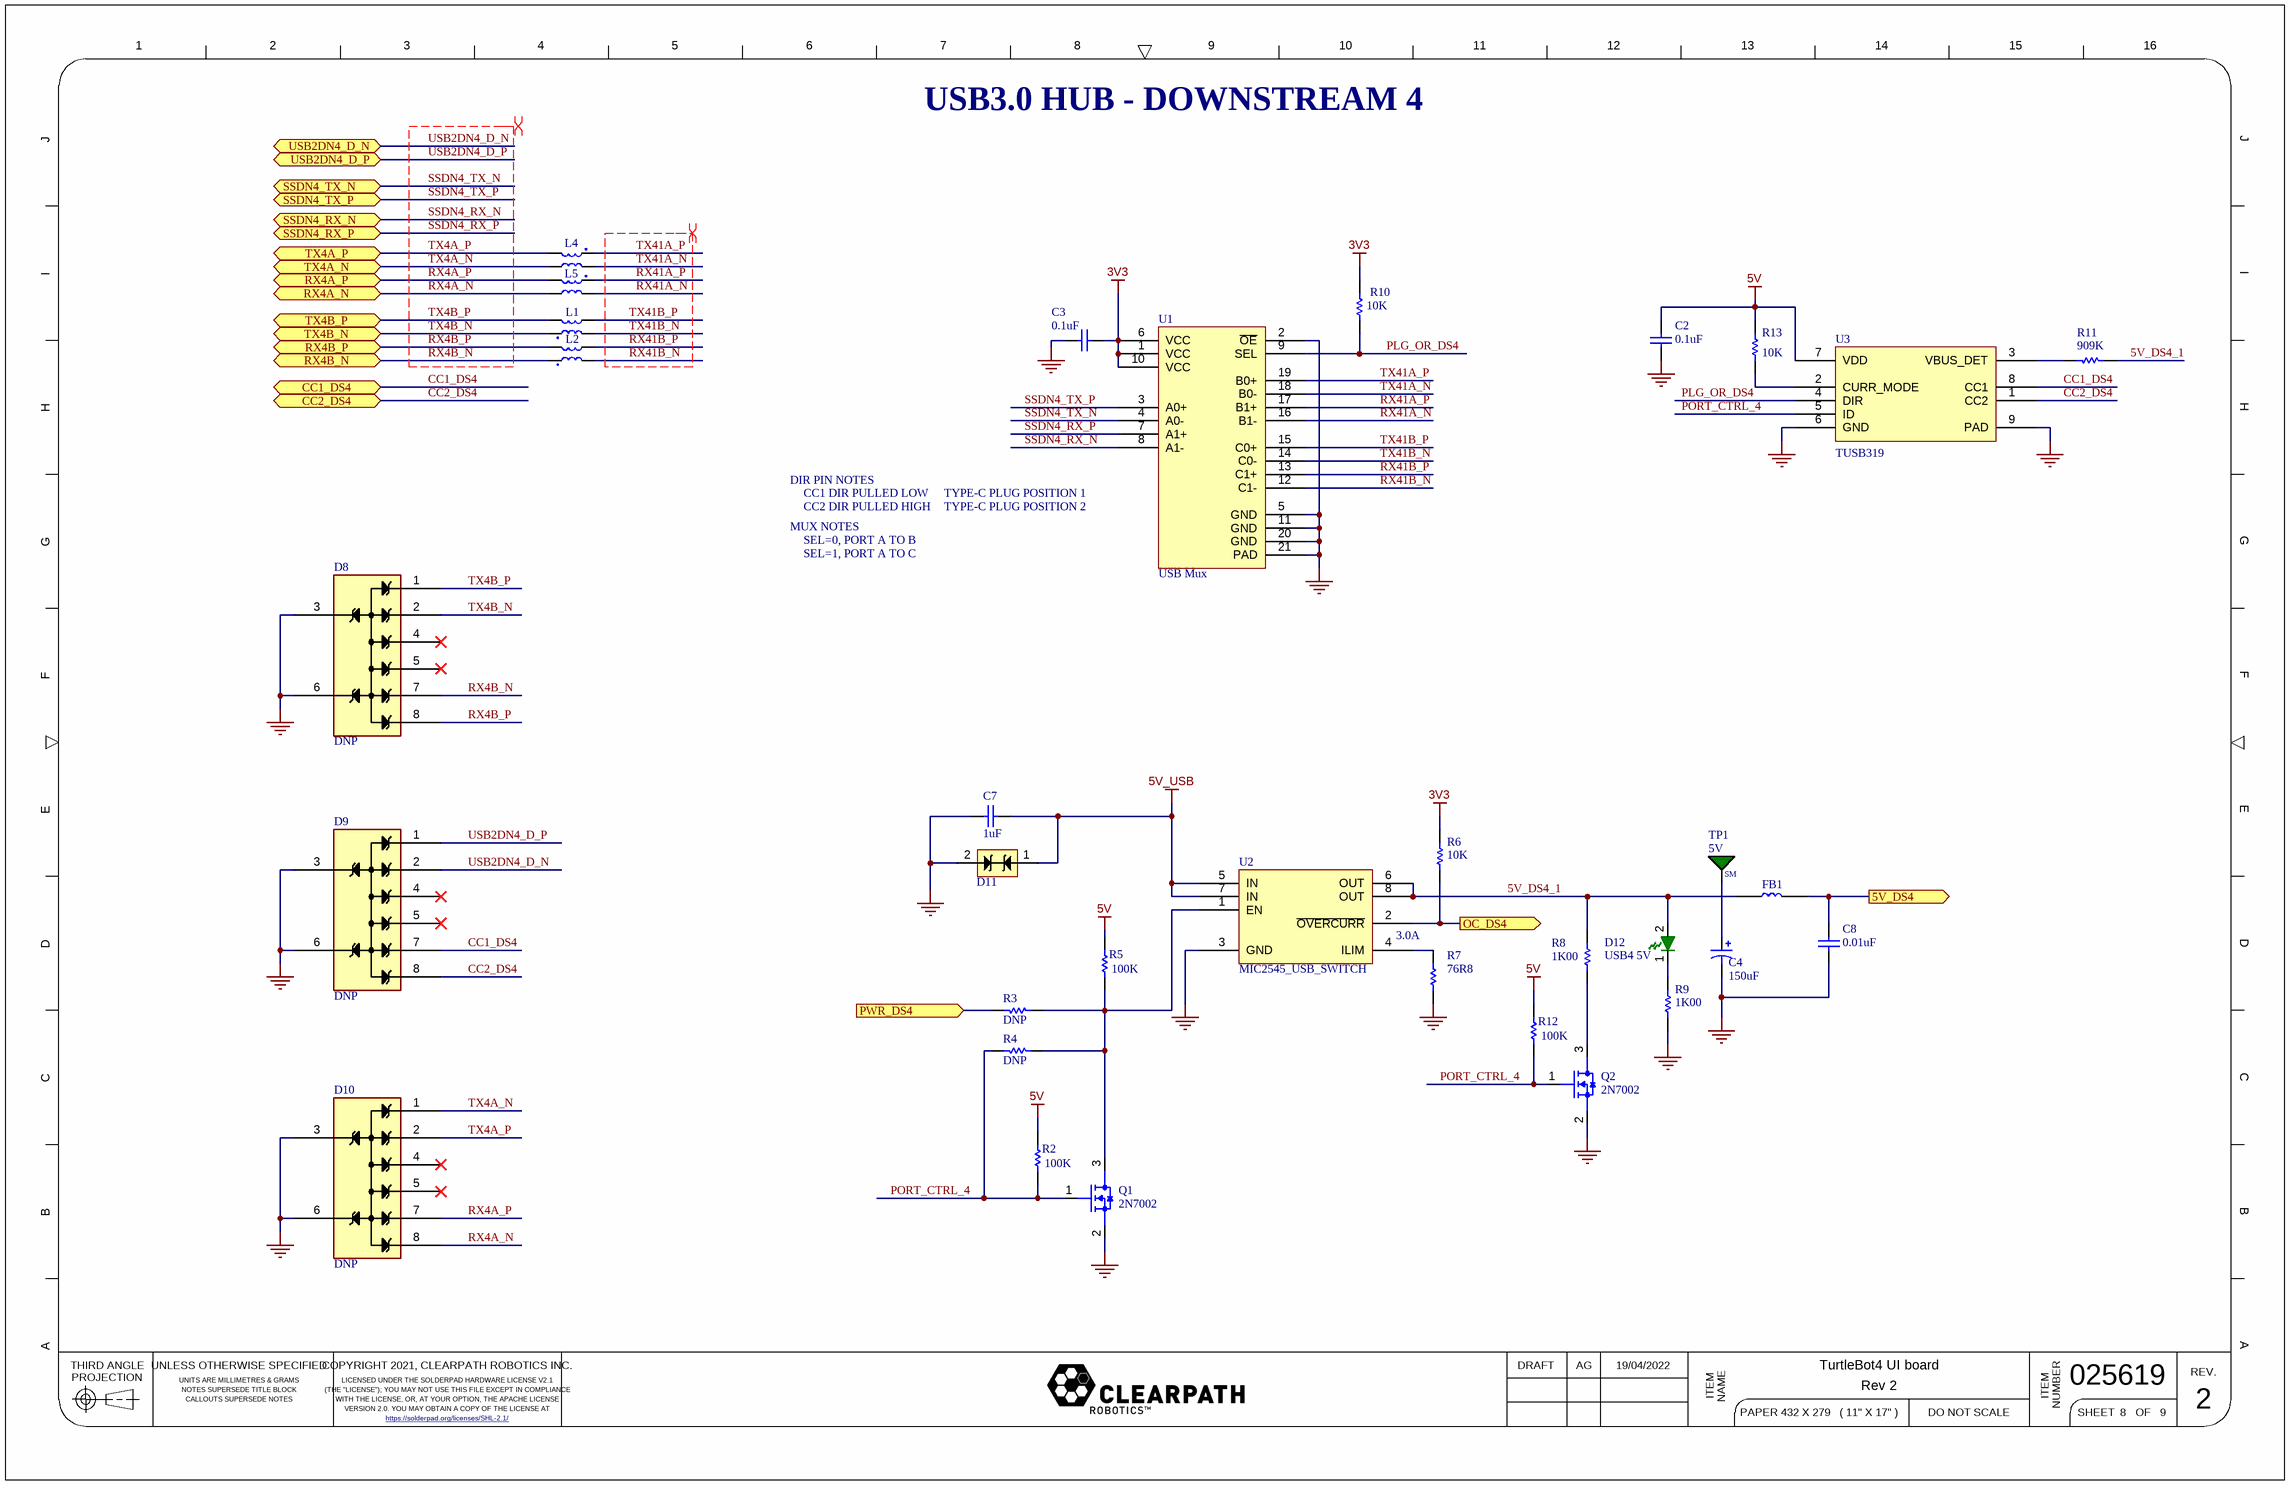
[diagram p3: USB Downstream Type C Port 4.SchDoc]

### Parts
C2  value 0.1uF  [C0805]  (hidden comment: Capacitor _SMT)
C3  value 0.1uF  [C0805]  (hidden comment: Capacitor _SMT)
C4  value 150uF  [CAPMP7.6X4.3_3.1N_KEM-M]  (hidden comment: Cap Tant)
C7  value 1uF  [C0805]  (hidden comment: Capacitor _SMT)
C8  value 0.01uF  [C0805]  (hidden comment: Capacitor _SMT)
D8  DNP  [ESD7016]
D9  DNP  [ESD7016]
D10  DNP  [ESD7016]
D11  TVS DIODE BIDIR 15V SMC  [DO-214AA]  (value not drawn)
D12  USB4 5V  [LED_0805_GRN]
FB1  742792602  [R0603]  (value not drawn)
L1  CMC 100MA 2LN 90 OHM SMD2  [cmc_90_ohms]  (value not drawn)
L2  CMC 100MA 2LN 90 OHM SMD2  [cmc_90_ohms]  (value not drawn)
L4  CMC 100MA 2LN 90 OHM SMD2  [cmc_90_ohms]  (value not drawn)
L5  CMC 100MA 2LN 90 OHM SMD2  [cmc_90_ohms]  (value not drawn)
Q1  Mfg PN: 2N7002  [SOT-23-3]  (hidden comment: NFET)
Q2  Mfg PN: 2N7002  [SOT-23-3]  (hidden comment: NFET)
R2  value 100K  [R0805]  (hidden comment: Resistor_SMT)
R3  value DNP  [R0805]  (hidden comment: Resistor_SMT)
R4  value DNP  [R0805]  (hidden comment: Resistor_SMT)
R5  value 100K  [R0805]  (hidden comment: Resistor_SMT)
R6  value 10K  [R0805]  (hidden comment: Resistor_SMT)
R7  3.0A  value 76R8  [R0805]
R8  value 1K00  [R0805]  (hidden comment: Resistor_SMT)
R9  value 1K00  [R0805]  (hidden comment: Resistor_SMT)
R10  value 10K  [R0805]  (hidden comment: Resistor_SMT)
R11  value 909K  [R0805]  (hidden comment: Resistor_SMT)
R12  value 100K  [R0805]  (hidden comment: Resistor_SMT)
R13  value 10K  [R0805]  (hidden comment: Resistor_SMT)
TP1  5V  [TP_28SM]
U1  USB Mux  [TQFN20]
U2  MIC2545_USB_SWITCH  [SOIC-8-150]
U3  TUSB319  [WSON8]

### Ports
5V_DS4 (out), CC1_DS4 (bidir), CC2_DS4 (bidir), OC_DS4 (out), PWR_DS4 (in), RX4A_N (bidir), RX4A_P (bidir), RX4B_N (bidir), RX4B_P (bidir), SSDN4_RX_N (bidir), SSDN4_RX_P (bidir), SSDN4_TX_N (bidir), SSDN4_TX_P (bidir), TX4A_N (bidir), TX4A_P (bidir), TX4B_N (bidir), TX4B_P (bidir), USB2DN4_D_N (bidir), USB2DN4_D_P (bidir)

### Nets
3V3: C3.1 R6.1 R10.1 U1.1(VCC) U1.6(VCC) U1.10(VCC)
5V: C2.1 R2.2 R5.2 R12.2 R13.1 U3.7(VDD)
5V_USB: C7.2 D11.1 U2.5(IN) U2.7(IN)
GND: C2.2 C3.2 C4.2 C7.1 C8.2 D8.3 D8.6 D9.3 D9.6 D10.3 D10.6 D11.2 Q1.2(D1) Q2.2(D1) R7.1 R9.2 U1.2(~{OE}) U1.5(GND) U1.11(GND) U1.20(GND) U1.21(PAD) U2.3(GND) U3.6(GND) U3.9(PAD)
5V_DS4: C8.1 FB1.2 ; port 5V_DS4
5V_DS4_1: D12.2(RA) FB1.1 R8.1 R11.2 U2.6(OUT) U2.8(OUT)
CC1_DS4: D9.7 U3.8(CC1) ; port CC1_DS4
CC2_DS4: D9.8 U3.1(CC2) ; port CC2_DS4
OC_DS4: R6.2 U2.2(~{OVERCURR}) ; port OC_DS4
PLG_OR_DS4: R10.2 U1.9(SEL) U3.4(DIR)
PORT_CTRL_4: Q1.1(G1) Q2.1(G1) R2.1 R4.1 R12.1 U3.5(ID)
PWR_DS4: R3.1 ; port PWR_DS4
RX4A_N: D10.8 L5.3 ; port RX4A_N
RX4A_P: D10.7 L5.4 ; port RX4A_P
RX4B_N: D8.7 L2.1 ; port RX4B_N
RX4B_P: D8.8 L2.2 ; port RX4B_P
RX41A_N: L5.2 U1.16(B1-)
RX41A_P: L5.1 U1.17(B1+)
RX41B_N: L2.4 U1.12(C1-)
RX41B_P: L2.3 U1.13(C1+)
SSDN4_RX_N: U1.8(A1-) ; port SSDN4_RX_N
SSDN4_RX_P: U1.7(A1+) ; port SSDN4_RX_P
SSDN4_TX_N: U1.4(A0-) ; port SSDN4_TX_N
SSDN4_TX_P: U1.3(A0+) ; port SSDN4_TX_P
TX4A_N: D10.1 L4.3 ; port TX4A_N
TX4A_P: D10.2 L4.4 ; port TX4A_P
TX4B_N: D8.2 L1.1 ; port TX4B_N
TX4B_P: D8.1 L1.2 ; port TX4B_P
TX41A_N: L4.2 U1.18(B0-)
TX41A_P: L4.1 U1.19(B0+)
TX41B_N: L1.4 U1.14(C0-)
TX41B_P: L1.3 U1.15(C0+)
USB2DN4_D_N: D9.2 ; port USB2DN4_D_N
USB2DN4_D_P: D9.1 ; port USB2DN4_D_P
NetC4_1: C4.1 TP1.1
NetD12_1: D12.1(RK) R9.1
NetQ1_3: Q1.3(S1) R3.2 R4.2 R5.1 U2.1(EN)
NetQ2_3: Q2.3(S1) R8.2
NetR7_2: R7.2 U2.4(ILIM)
NetR11_1: R11.1 U3.3(VBUS_DET)
NetR13_2: R13.2 U3.2(CURR_MODE)

Not connected (* = marked no-connect by the designer): D8 4* 5*; D9 4* 5*; D10 4* 5*

### Layout directives
differential pair; net class USB3; differential pair class DIFF90; rule Matched Net Lengths [Tolerance = 15mil]: RX4A_N, RX4A_P, RX4B_N, RX4B_P, RX41A_N, RX41A_P, RX41B_N, RX41B_P, SSDN4_RX_N, SSDN4_RX_P, SSDN4_TX_N, SSDN4_TX_P, TX4A_N, TX4A_P, TX4B_N, TX4B_P, TX41A_N, TX41A_P, TX41B_N, TX41B_P, USB2DN4_D_N, USB2DN4_D_P

### Notes on the sheet
- USB3.0 HUB - DOWNSTREAM 4
- DIR PIN NOTES
- CC1 DIR PULLED LOW
- TYPE-C PLUG POSITION 1
- MUX NOTES
- CC2 DIR PULLED HIGH
- SEL=0, PORT A TO B
- SEL=1, PORT A TO C
- TYPE-C PLUG POSITION 2
- 1
- 2
- 3
- 4
- 5
- 6
- 7
- 8
- 9
- 10
- 11
- 12
- 13
- 14
- 15
- 16
- J
- I
- H
- G
- F
- E
- D
- C
- B
- A
- THIRD ANGLE
- PROJECTION
- UNLESS OTHERWISE SPECIFIED
- COPYRIGHT 2021, CLEARPATH ROBOTICS INC.
- DRAFT
- REV.
- UNITS ARE MILLIMETRES & GRAMS
- NOTES SUPERSEDE TITLE BLOCK
- CALLOUTS SUPERSEDE NOTES
- LICENSED UNDER THE SOLDERPAD HARDWARE LICENSE V2.1
- (THE "LICENSE"); YOU MAY NOT USE THIS FILE EXCEPT IN COMPLIANCE
- WITH THE LICENSE, OR, AT YOUR OPTION, THE APACHE LICENSE
- VERSION 2.0. YOU MAY OBTAIN A COPY OF THE LICENSE AT
- https://solderpad.org/licenses/SHL-2.1/ <https://solderpad.https://solderpad.org/licenses/SHL-2.1/org/licenses/SHL-2.1/>
- ITEM
- NAME
- PAPER 432 X 279   ( 11" X 17" )
- DO NOT SCALE
- NUMBER
- SHEET
- OF
- (in symbol TP_28SM) SM

### Library data of the parts
C2 C3 = Capacitor _SMT: as C1 on sheet Top Level; DNP: *; Package: 0805
C4 = Cap Pol1: CAP TANT 150UF 10% 16V 2917; Vendor: Digikey; Mfg PN: 293D157X9016D2TE3; Vendor PN: 718-1746-1-ND; Mfg: Vishay Sprague; Voltage: 16V; Tolerance: 10%; Package: 2917; Supplier 1: Digi-Key; Supplier Part Number 1: 718-1746-1-ND
C7 = Capacitor _SMT: Capacitor; Tolerance: -20 +80; Voltage: 50V; Vendor: Digikey; Vendor PN: 311-1909-1-ND; Mfg: Yageo; Mfg PN: CC0805ZKY5V9BB105; DNP: *; Package: 0805
C8 = Capacitor _SMT: Capacitor; Tolerance: 10%; Voltage: 50V; Vendor: Digikey; Vendor PN: 1276-CL10B103KB8WPNDCT-ND; Mfg: Samsung Electro-Mechanics; Mfg PN: CL10B103KB8WPND; DNP: *; Package: 0603; Supplier 1: Digi-Key; Supplier Part Number 1: 1276-CL10B103KB8WPNDCT-ND
D8-D10 = ESD7016: as D16 on sheet USB Distribution; Vendor 2 PN: *; Vendor 2: *
D11 = TVS DIODE BIDIR 15V SMC: as D20 on sheet User Interface; Package: DO214AC; Supplier 1: Digi-Key; Supplier Part Number 1: 18-SMA6J5.0CACT-ND
D12 = GREEN_LED: Green LED; Vendor: Digikey; Mfg PN: LTST-C170KGKT; Mfg: LiteOn; Vendor 1: 160-1414-1-ND; Package: 0805
FB1 = 742792602: 60 Ohms 1 Signal Line Ferrite Bead 0603 (1608 Metric) 3A 40mOhm; Supplier 1: Digi-Key; Supplier Part Number 1: 732-4660-1-ND
L1 L2 L4 L5 = CMC 90_Ohms: as L3 on sheet USB Distribution; Supplier 1: Digi-Key; Supplier Part Number 1: 490-16595-1-ND
Q1 Q2 = NFET_SNGL: as Q5 on sheet User Interface; Package: SOT23-3
R2 R5 R12 = Resistor_SMT: Resistor; Vendor: Digikey; Vendor PN: 311-100KCRCT-ND; Tolerance: 1%; Mfg: Yageo; Mfg PN: RC0805FR-07100KL; Power Rating: *; Package: 0805
R3 R4 = Resistor_SMT: Resistor; Vendor: Digikey; Vendor PN: 311-0.0ARCT-ND; Mfg: Yageo; Mfg PN: RC0805JR-070RL; Power Rating: *; Package: 0805
R6 R10 R13 = Resistor_SMT: as R21 on sheet User Interface; Power Rating: *; Package: 0805
  R6: Supplier 1: Digi-Key; Supplier Part Number 1: 311-10.0KCRTR-ND
R7 = Resistor_SMT: Resistor; Vendor: Digikey; Vendor PN: 311-76.8CRCT-ND; Tolerance: 1%; Mfg: Yageo; Mfg PN: RC0805FR-0776R8L; Power Rating: *; Package: 0805
R8 R9 = Resistor_SMT: as R23 on sheet User Interface; Power Rating: *; Package: 0805
R11 = Resistor_SMT: Resistor; Vendor: Digikey; Vendor PN: 311-909KCRCT-ND; Tolerance: 1%; Mfg: Yageo; Mfg PN: RC0805FR-07909KL; Power Rating: *; Package: 0805
TP1 = TP_28SM: Test point, 28 Mil exposed pad; Manufacturer: Clearpath Robotics Inc.; ID: 1; PCB Component: TP_28SM; Status: Draft; Vendor: Clearpath Robotics Inc.; Vendor PN: TP_28SM; Type: SM Pad; Features: Exposed 28mil pad; Octopart Link: N/A
U1 = TC7PCI3212: TC7PCI3212MT,LF USB3.0 Mux; Manufacturer: Toshiba; Vendor 1 PN: 757-TC7PCI3212MTLF; Vendor 1: Mouser; Package: TQFN-20; Mfg PN: TC7PCI3212MT,LF
U2 = MIC2545_USB_SWITCH: IC PWR SWITCH N-CHAN 1:1 8SOIC; Vendor PN: MIC2545A-1YM-CT-ND; Vendor: Digikey; Mfg PN: MIC2545A-1YM-TR; Mfg: Microchip; Package: SOIC8
U3 = TUSB319: USB Type C Controller; Vendor 1 PN: 595-TUSB319IDRFRQ1; Vendor 1: Mouser; Mfg PN: TUSB319IDRFRQ1; Mfg: Texas Instruments; Package: WSON8